# EAGLE schematic main (EAGLE 7.6.0), part 1 of 2
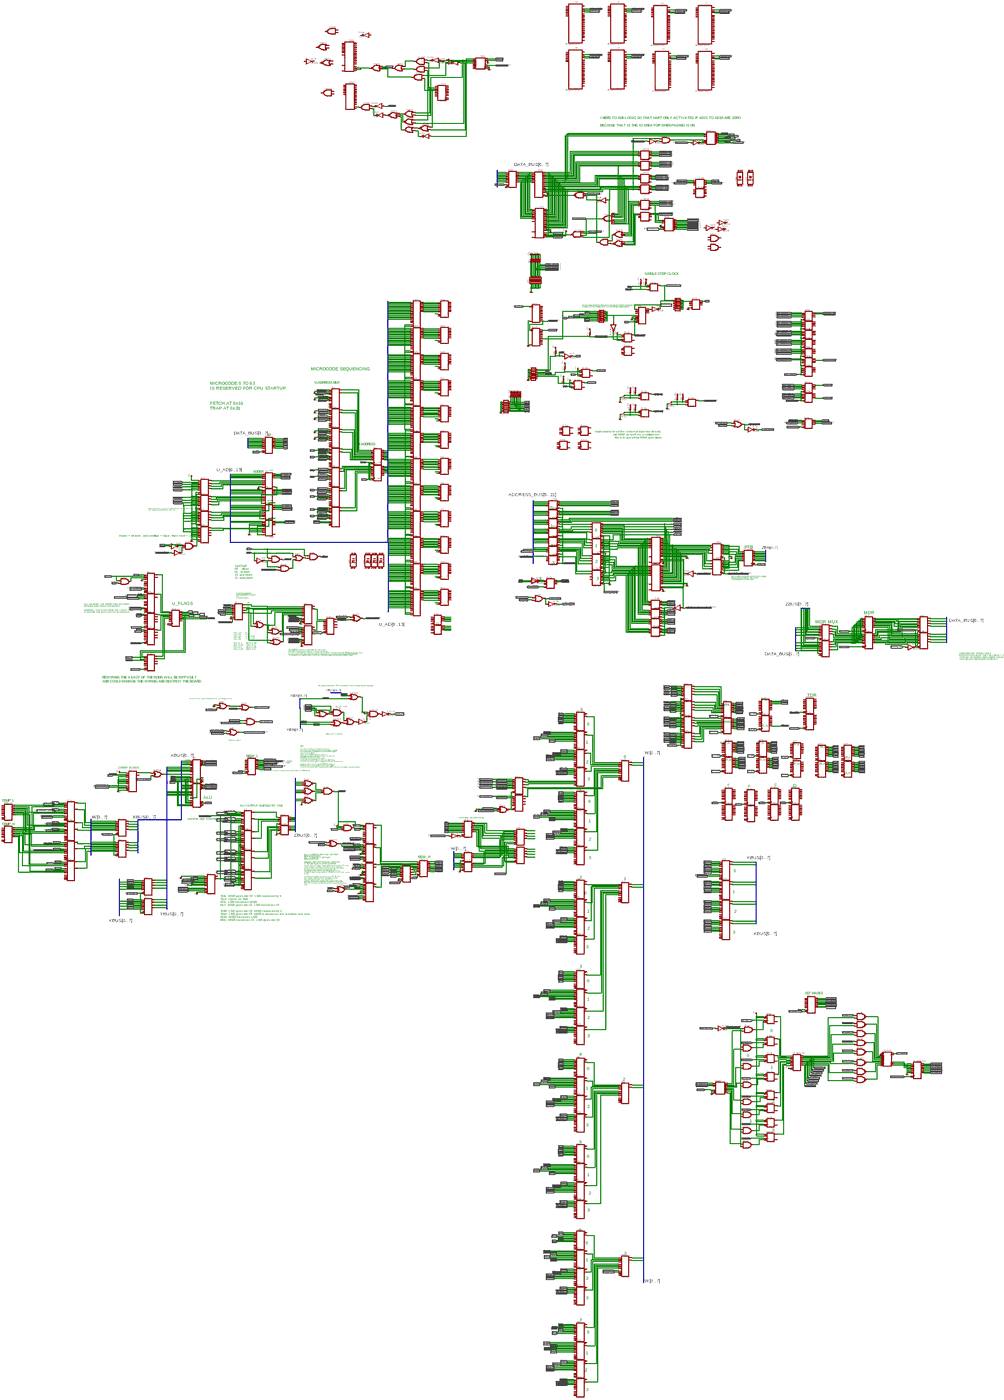
[diagram p0: schematic, sheet 1, overview]
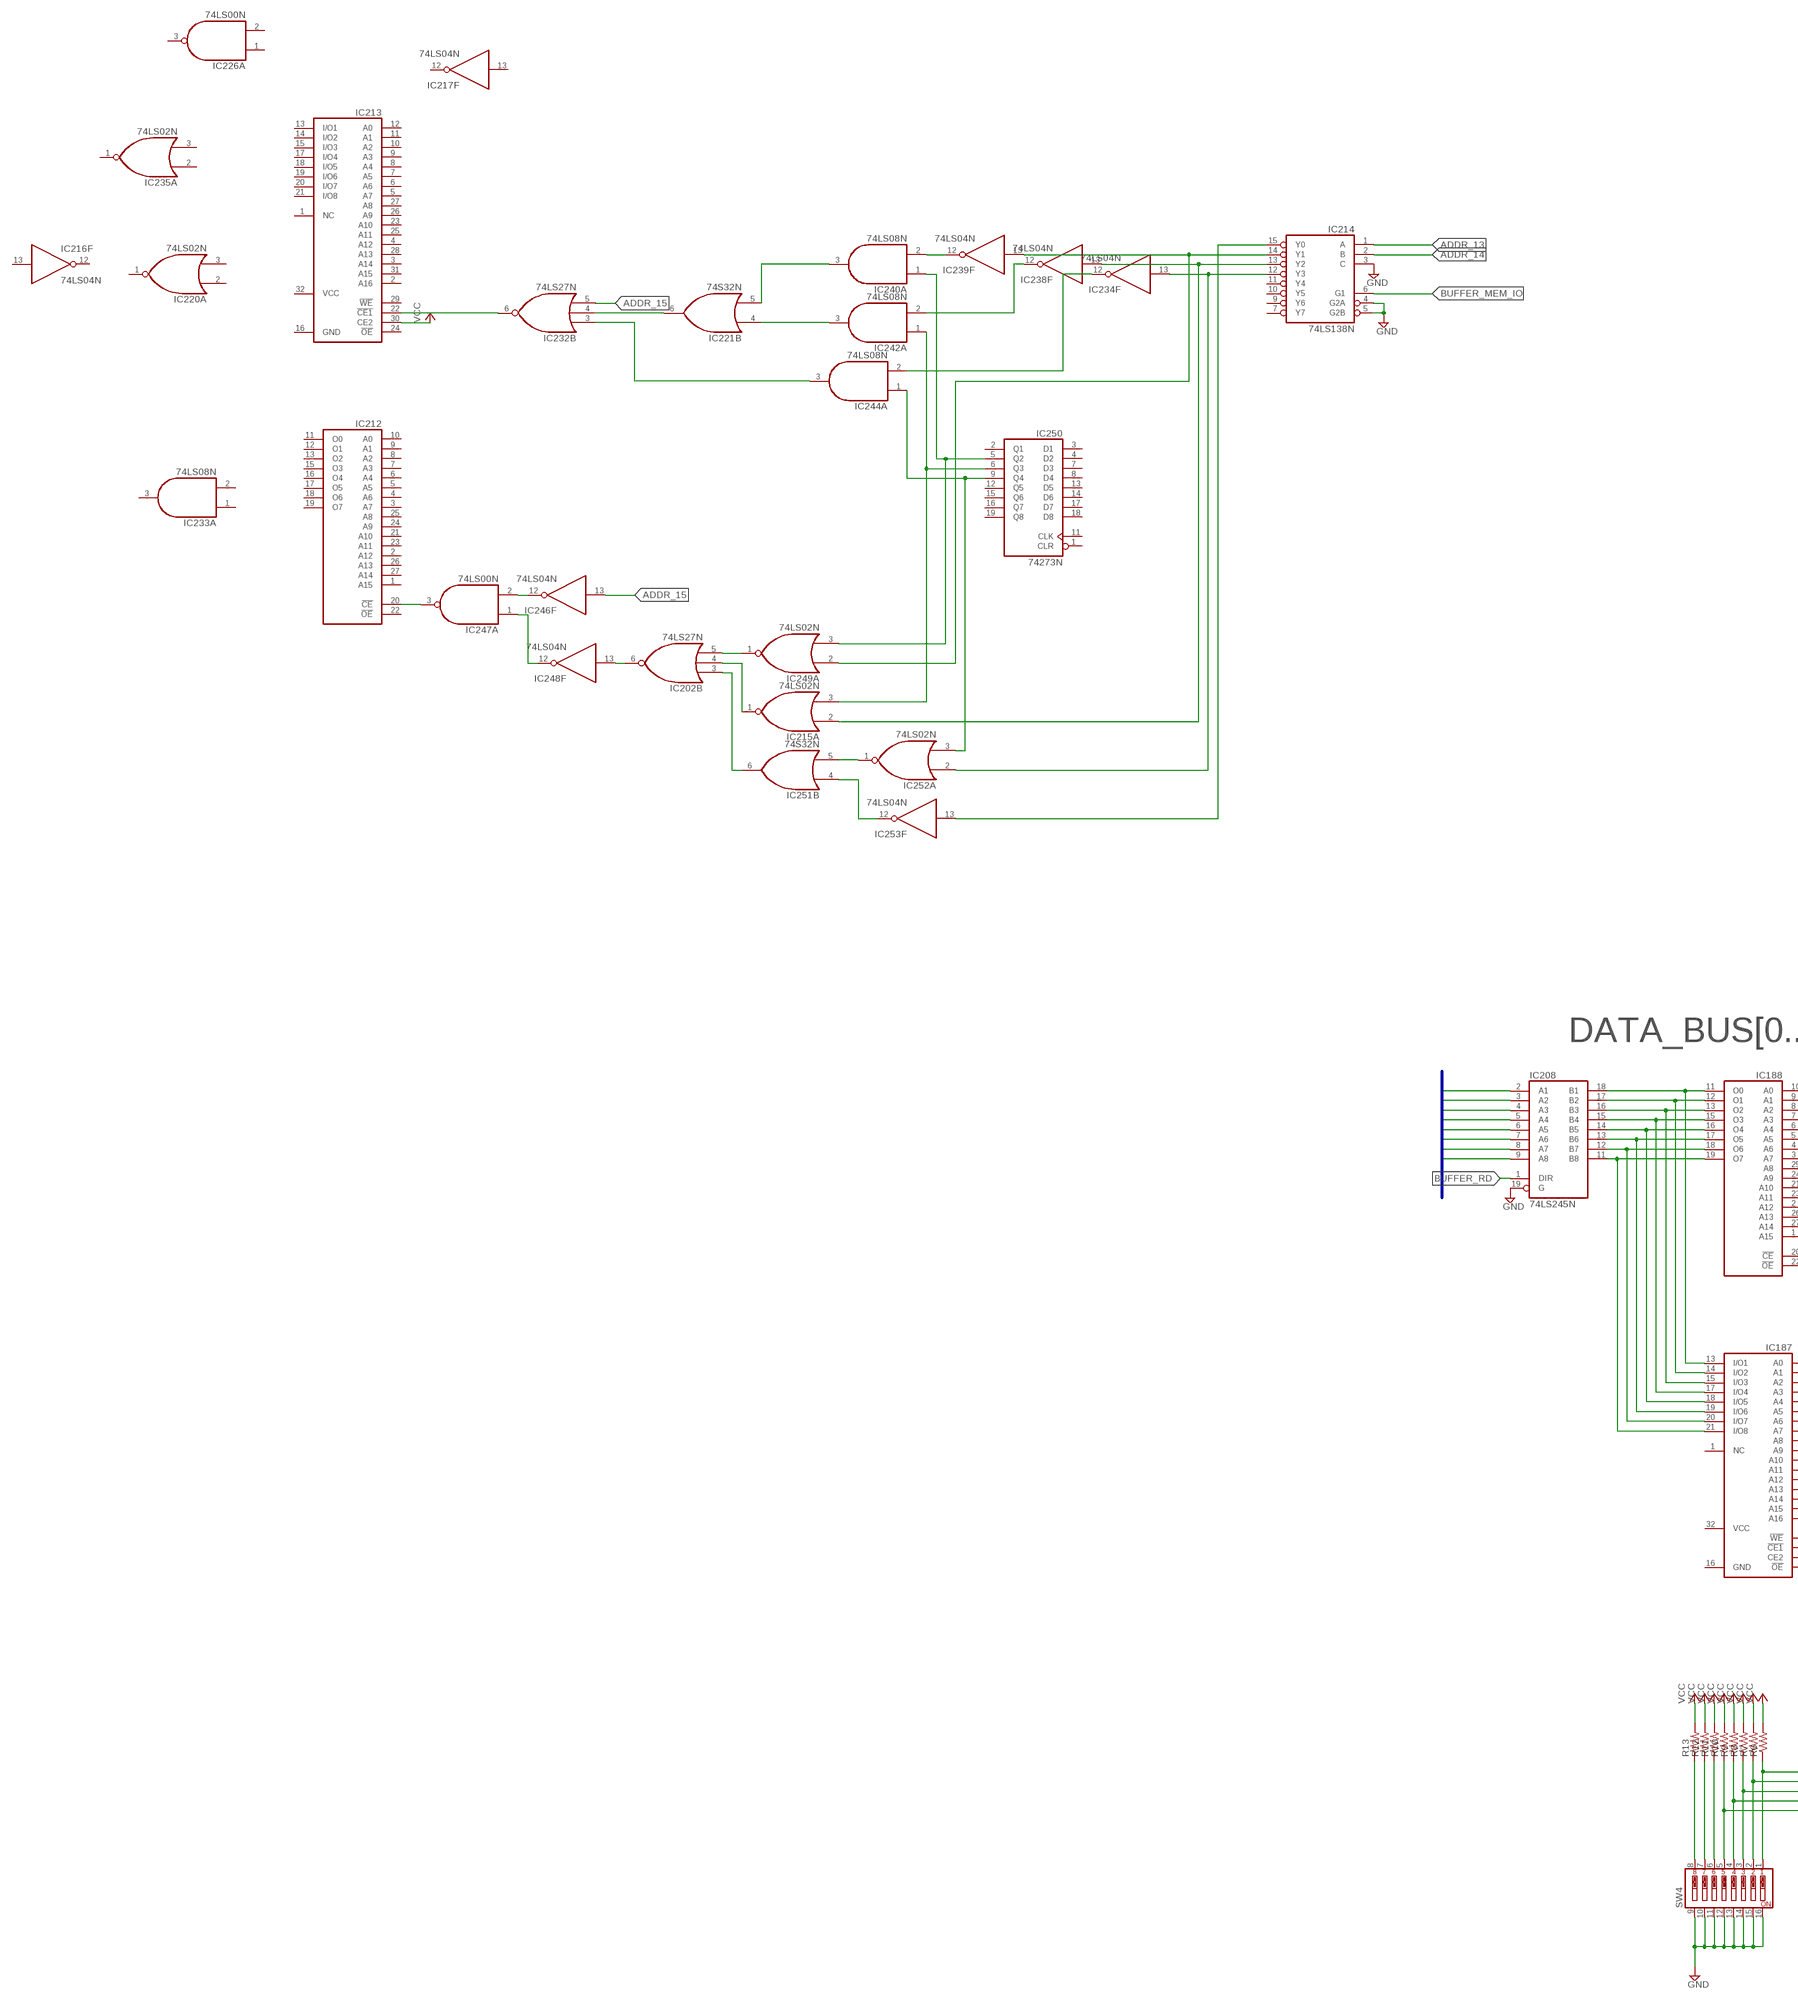
[diagram p1: schematic, sheet 1, part 1 of 8]
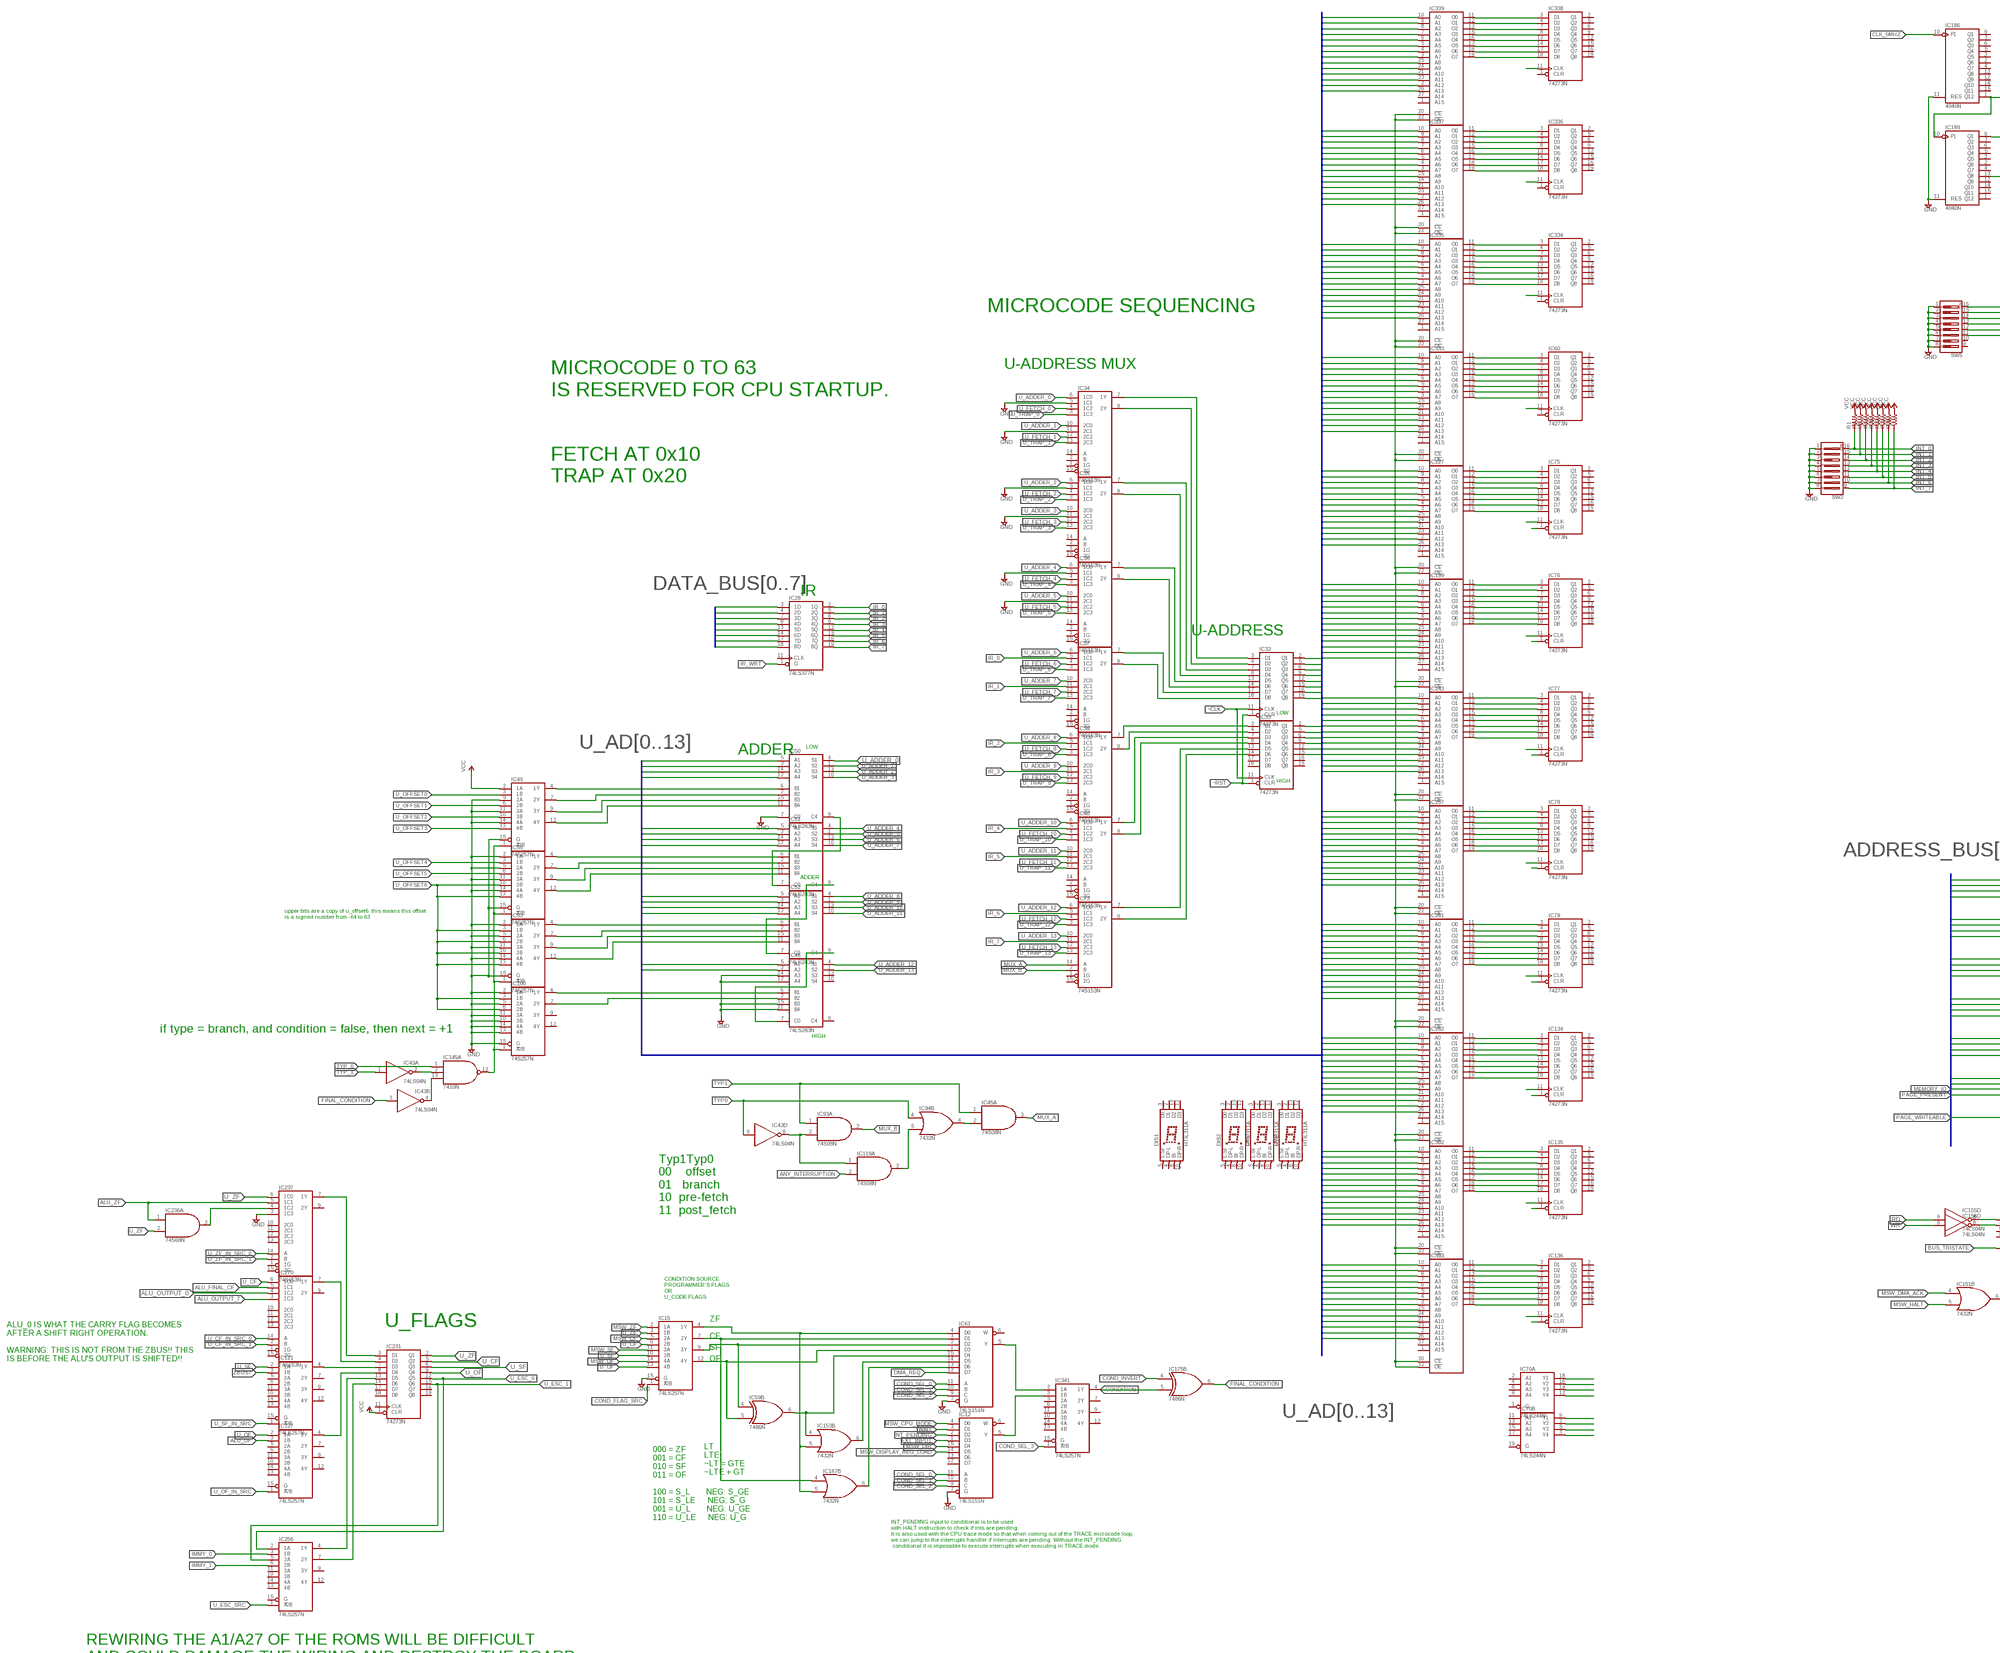
[diagram p2: schematic, sheet 1, part 2 of 8]
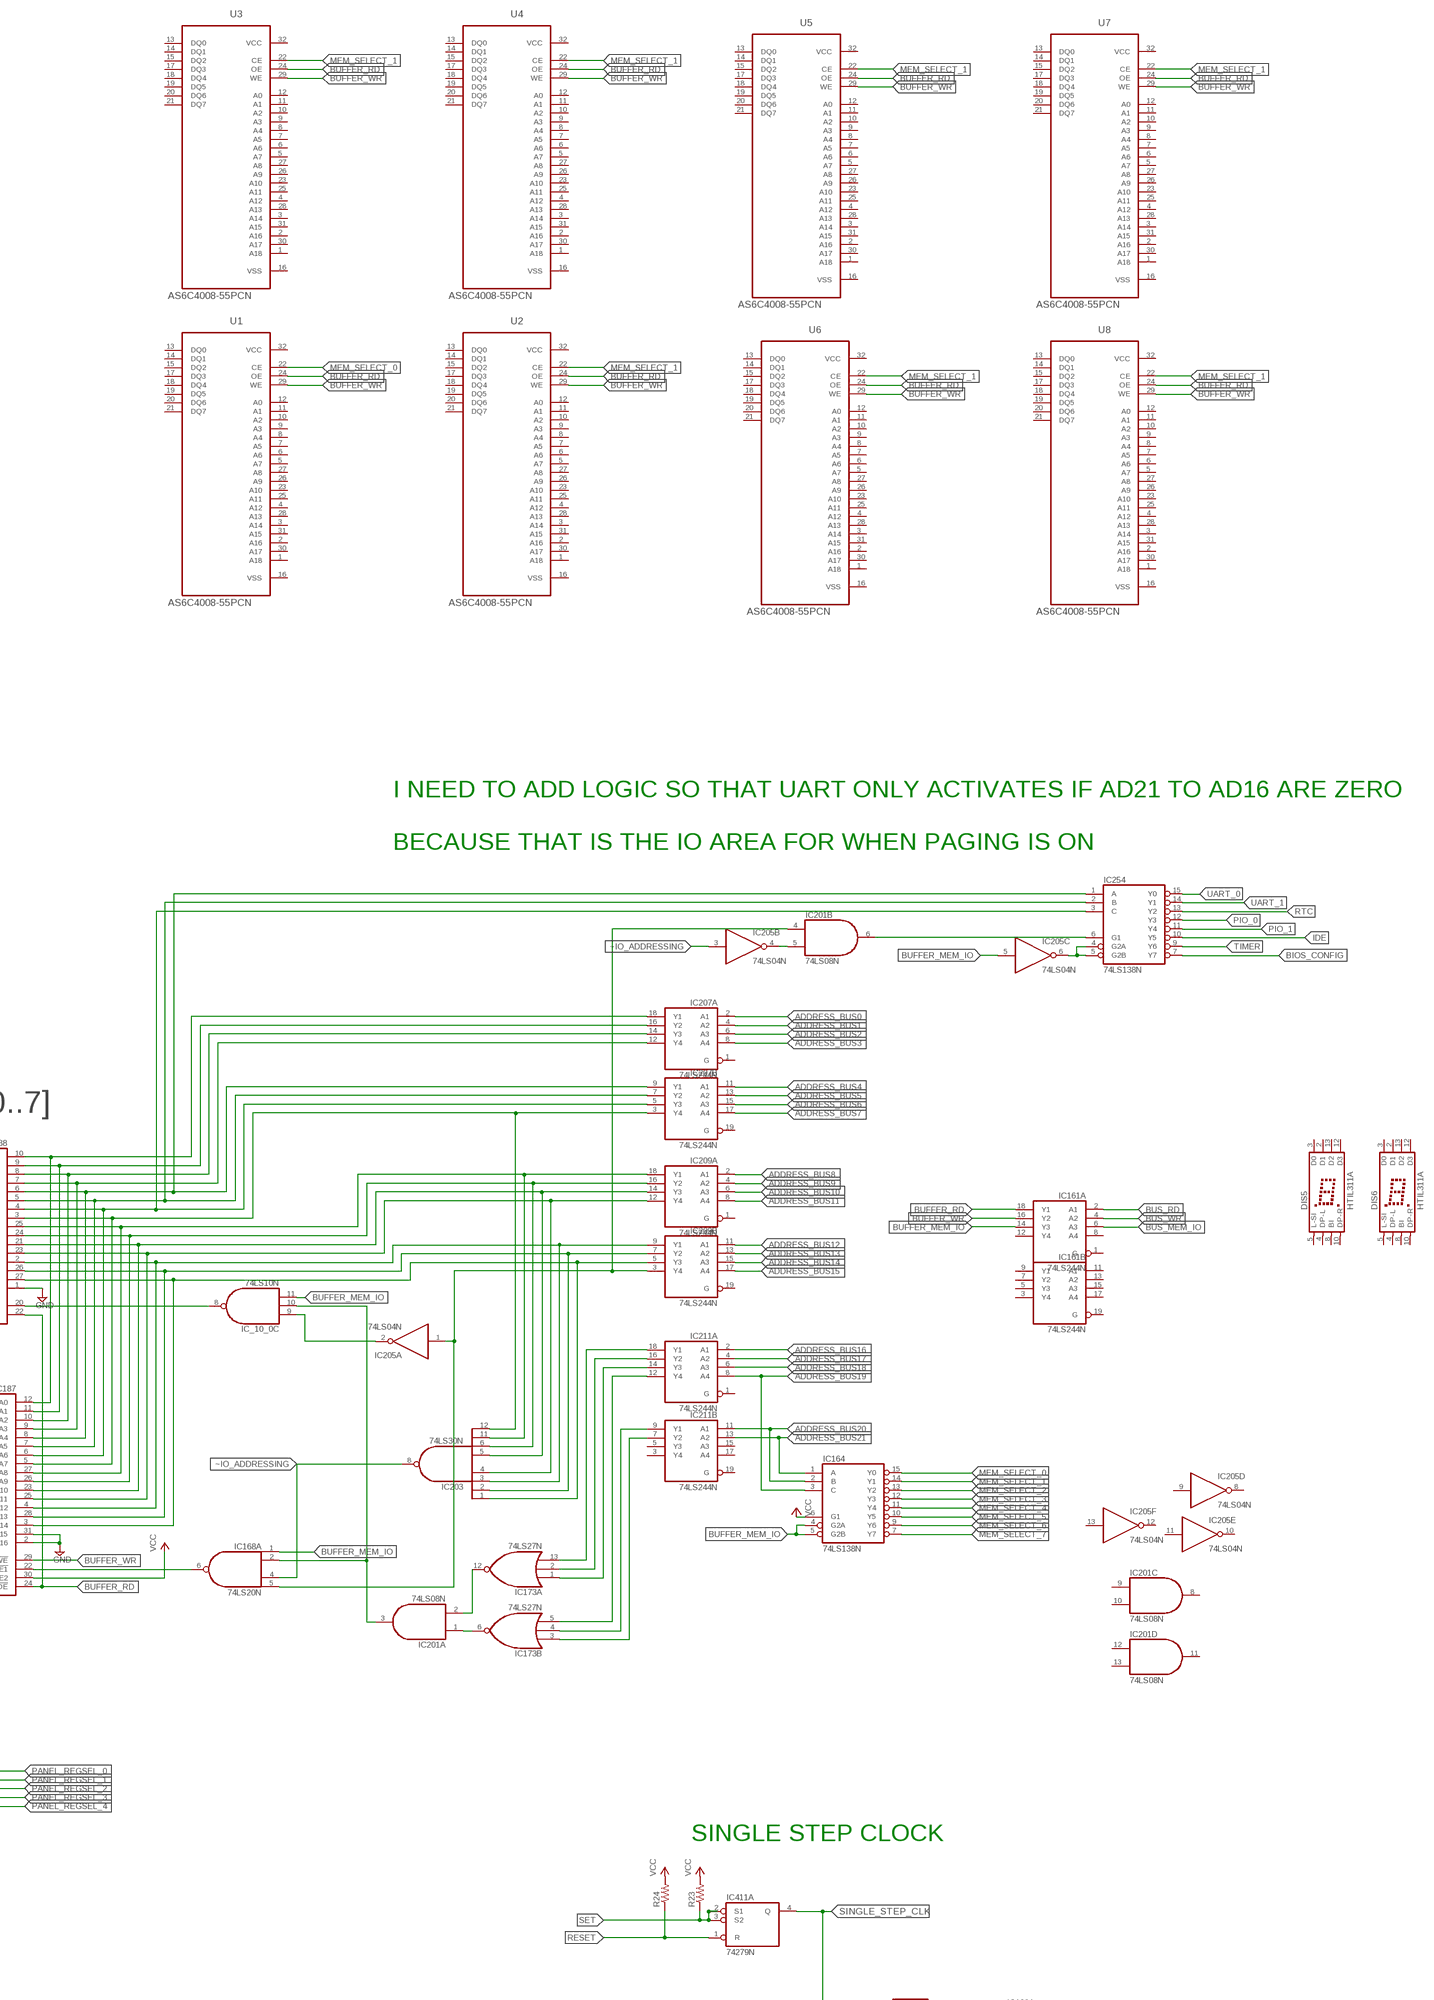
[diagram p3: schematic, sheet 1, part 3 of 8]
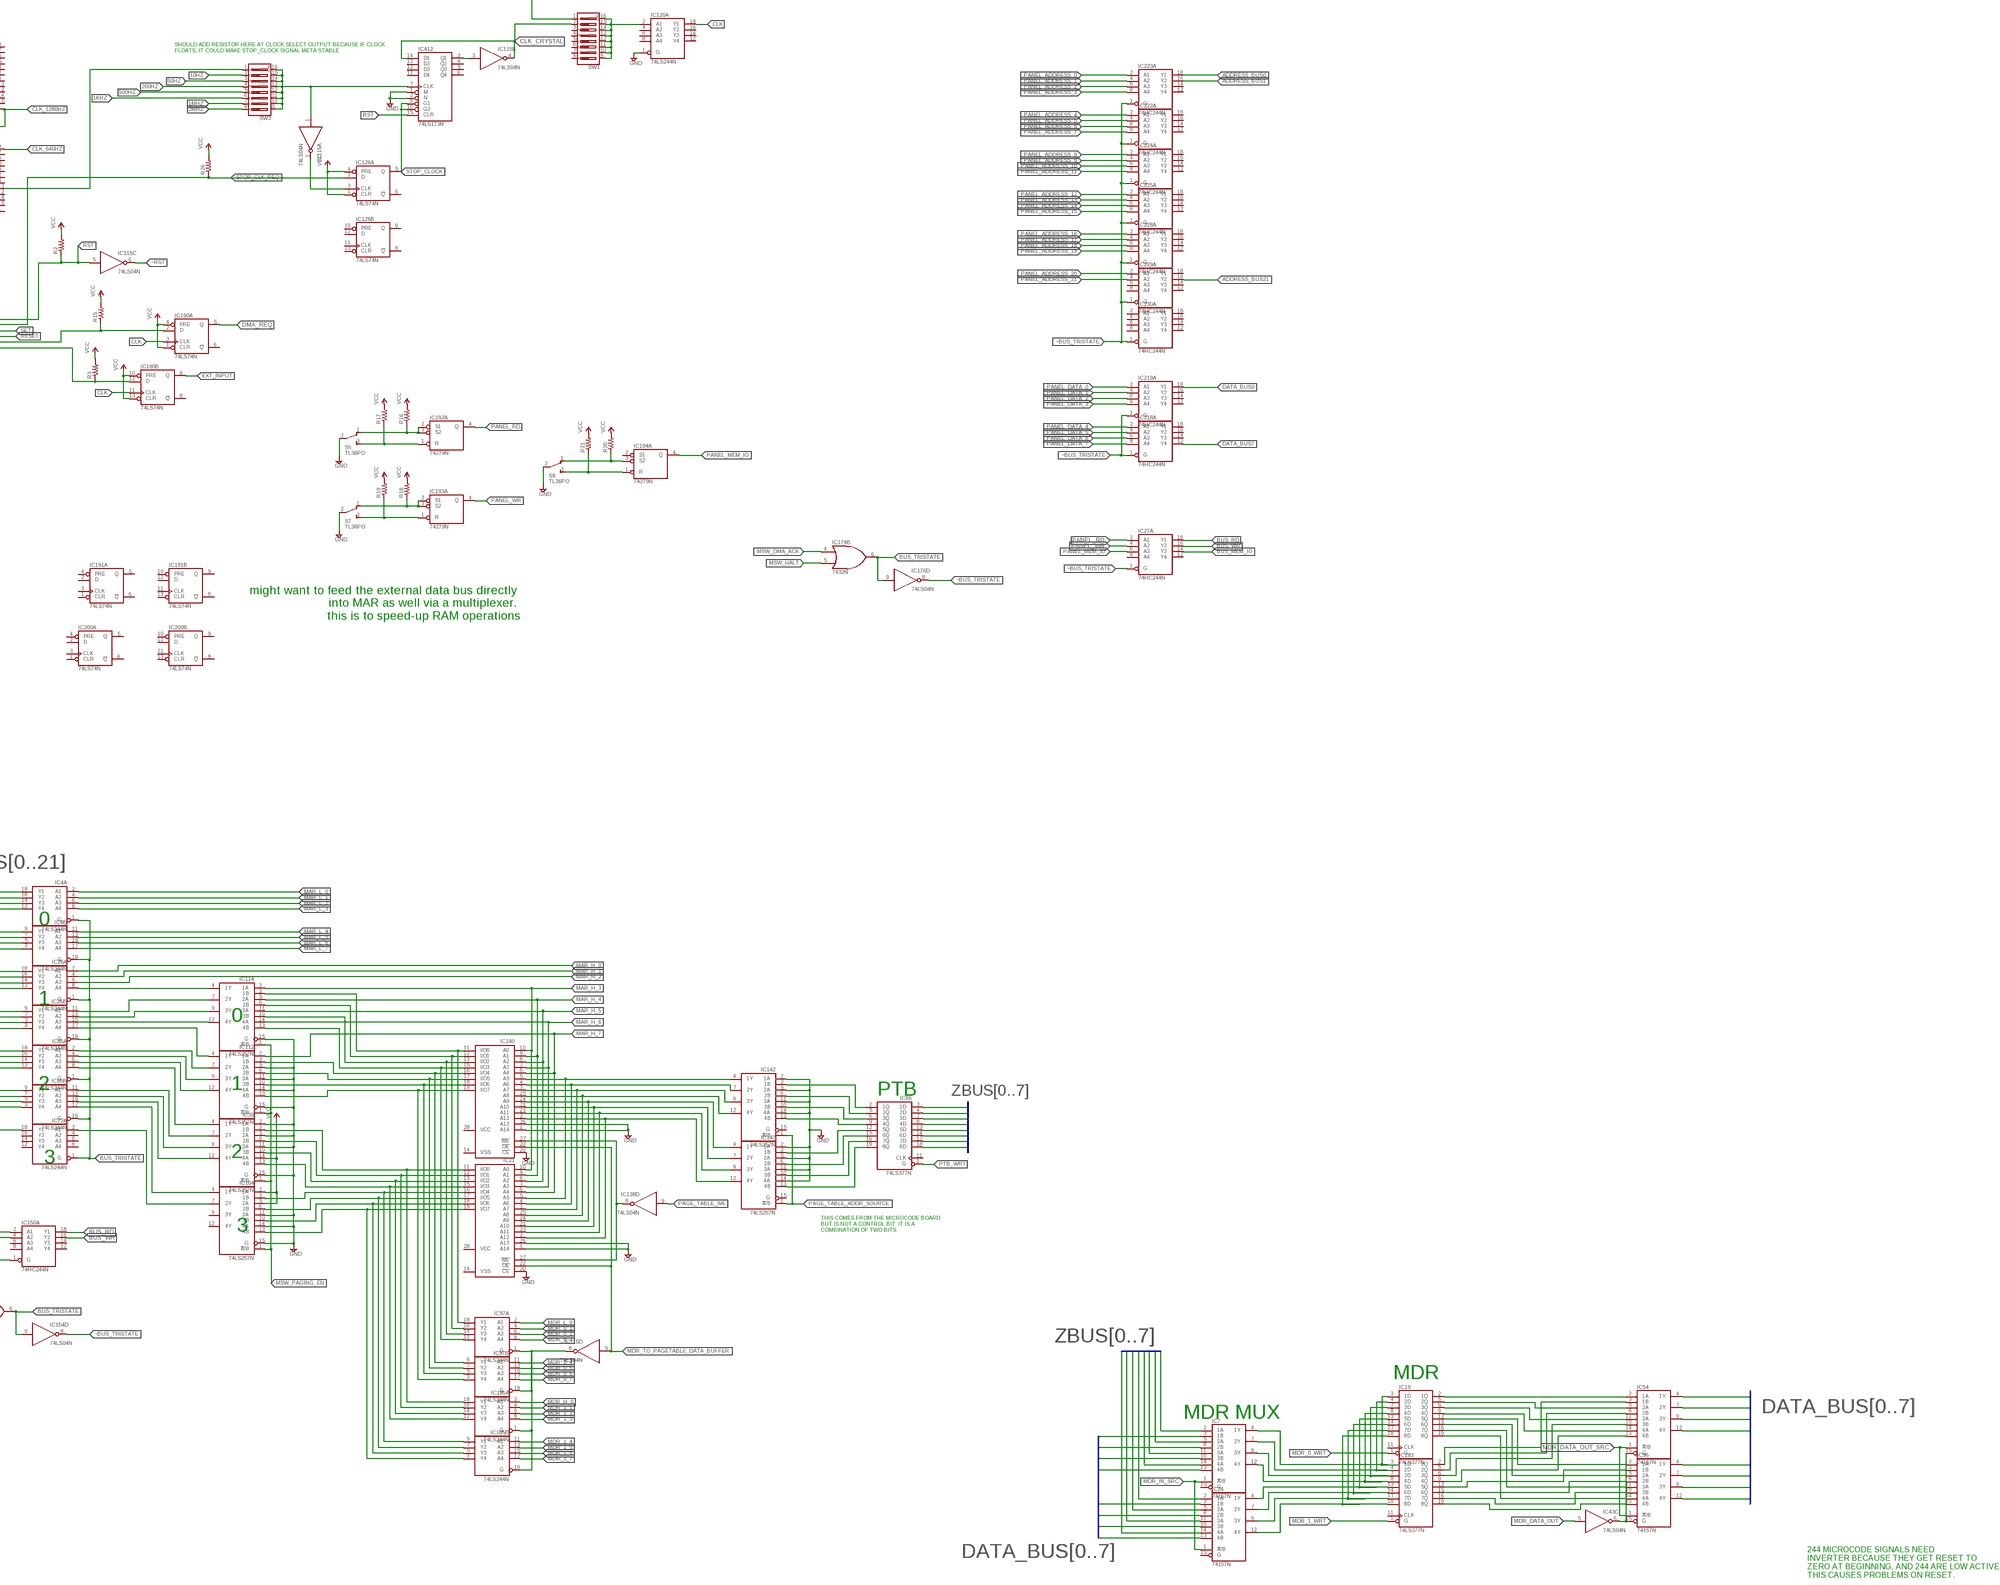
[diagram p4: schematic, sheet 1, part 4 of 8]
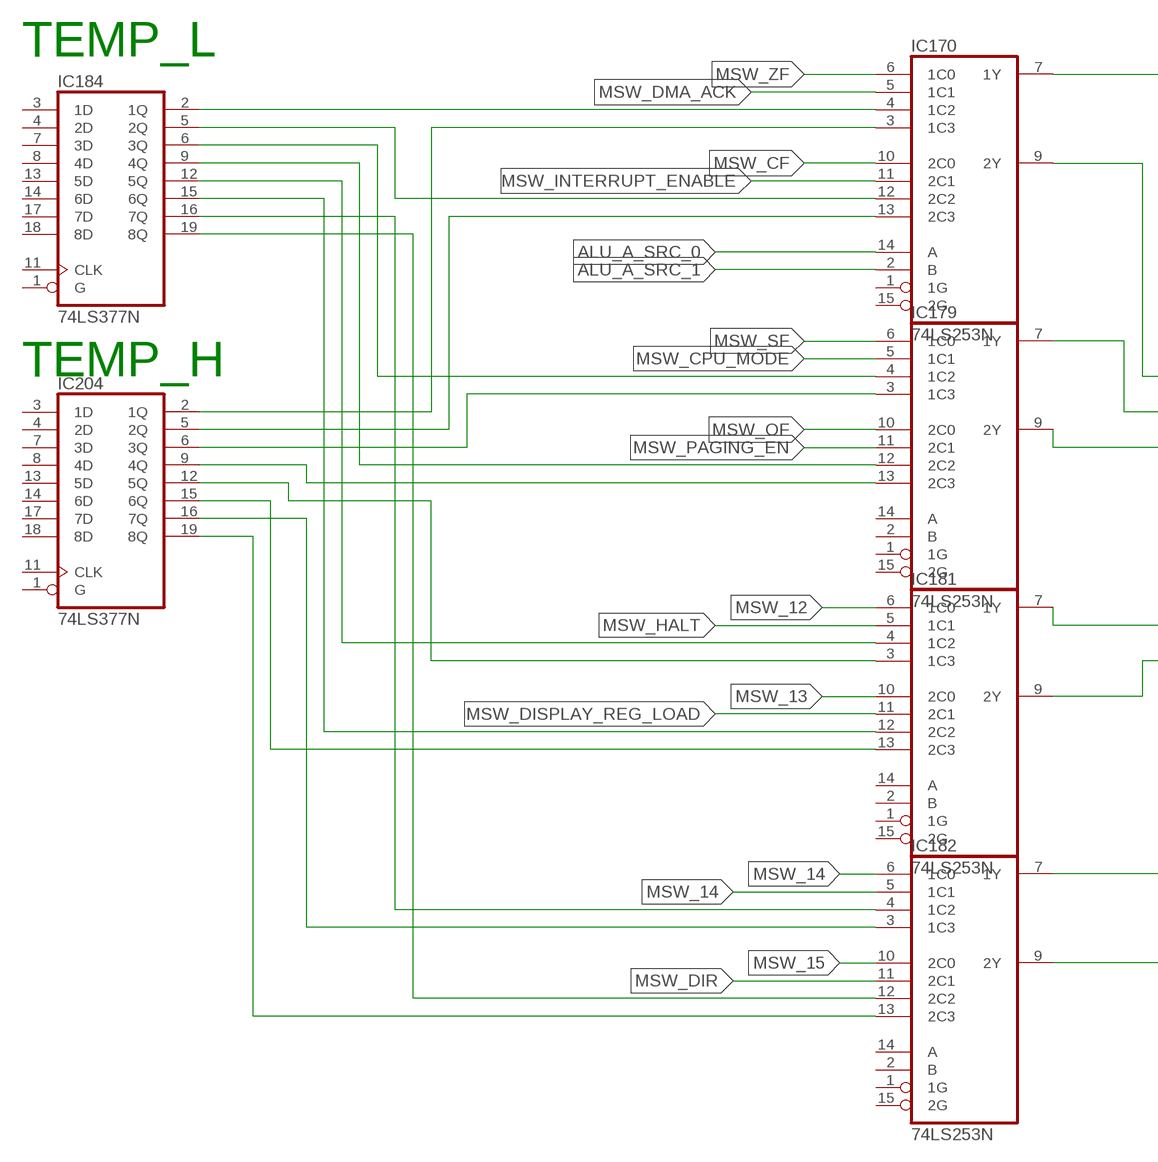
[diagram p5: schematic, sheet 1, part 5 of 8]
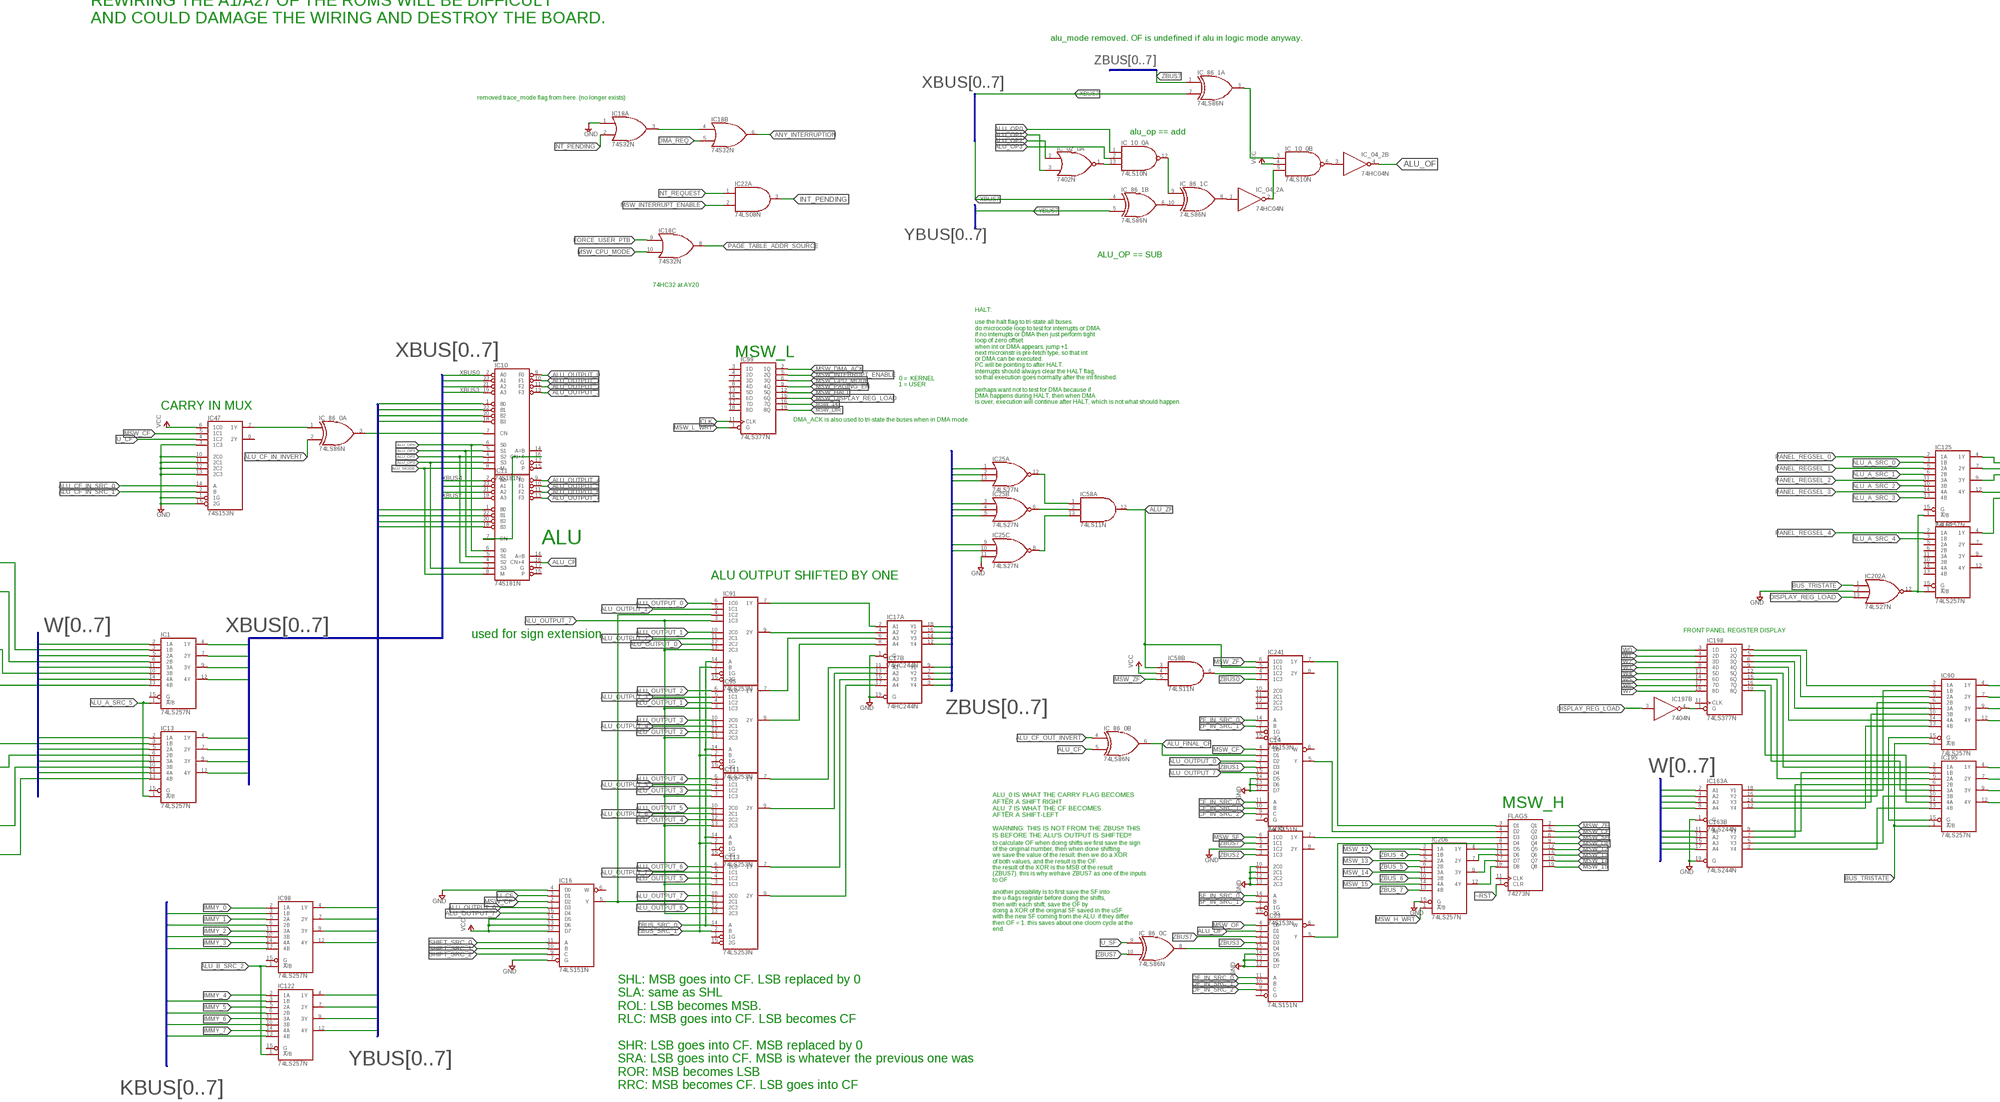
[diagram p6: schematic, sheet 1, part 6 of 8]
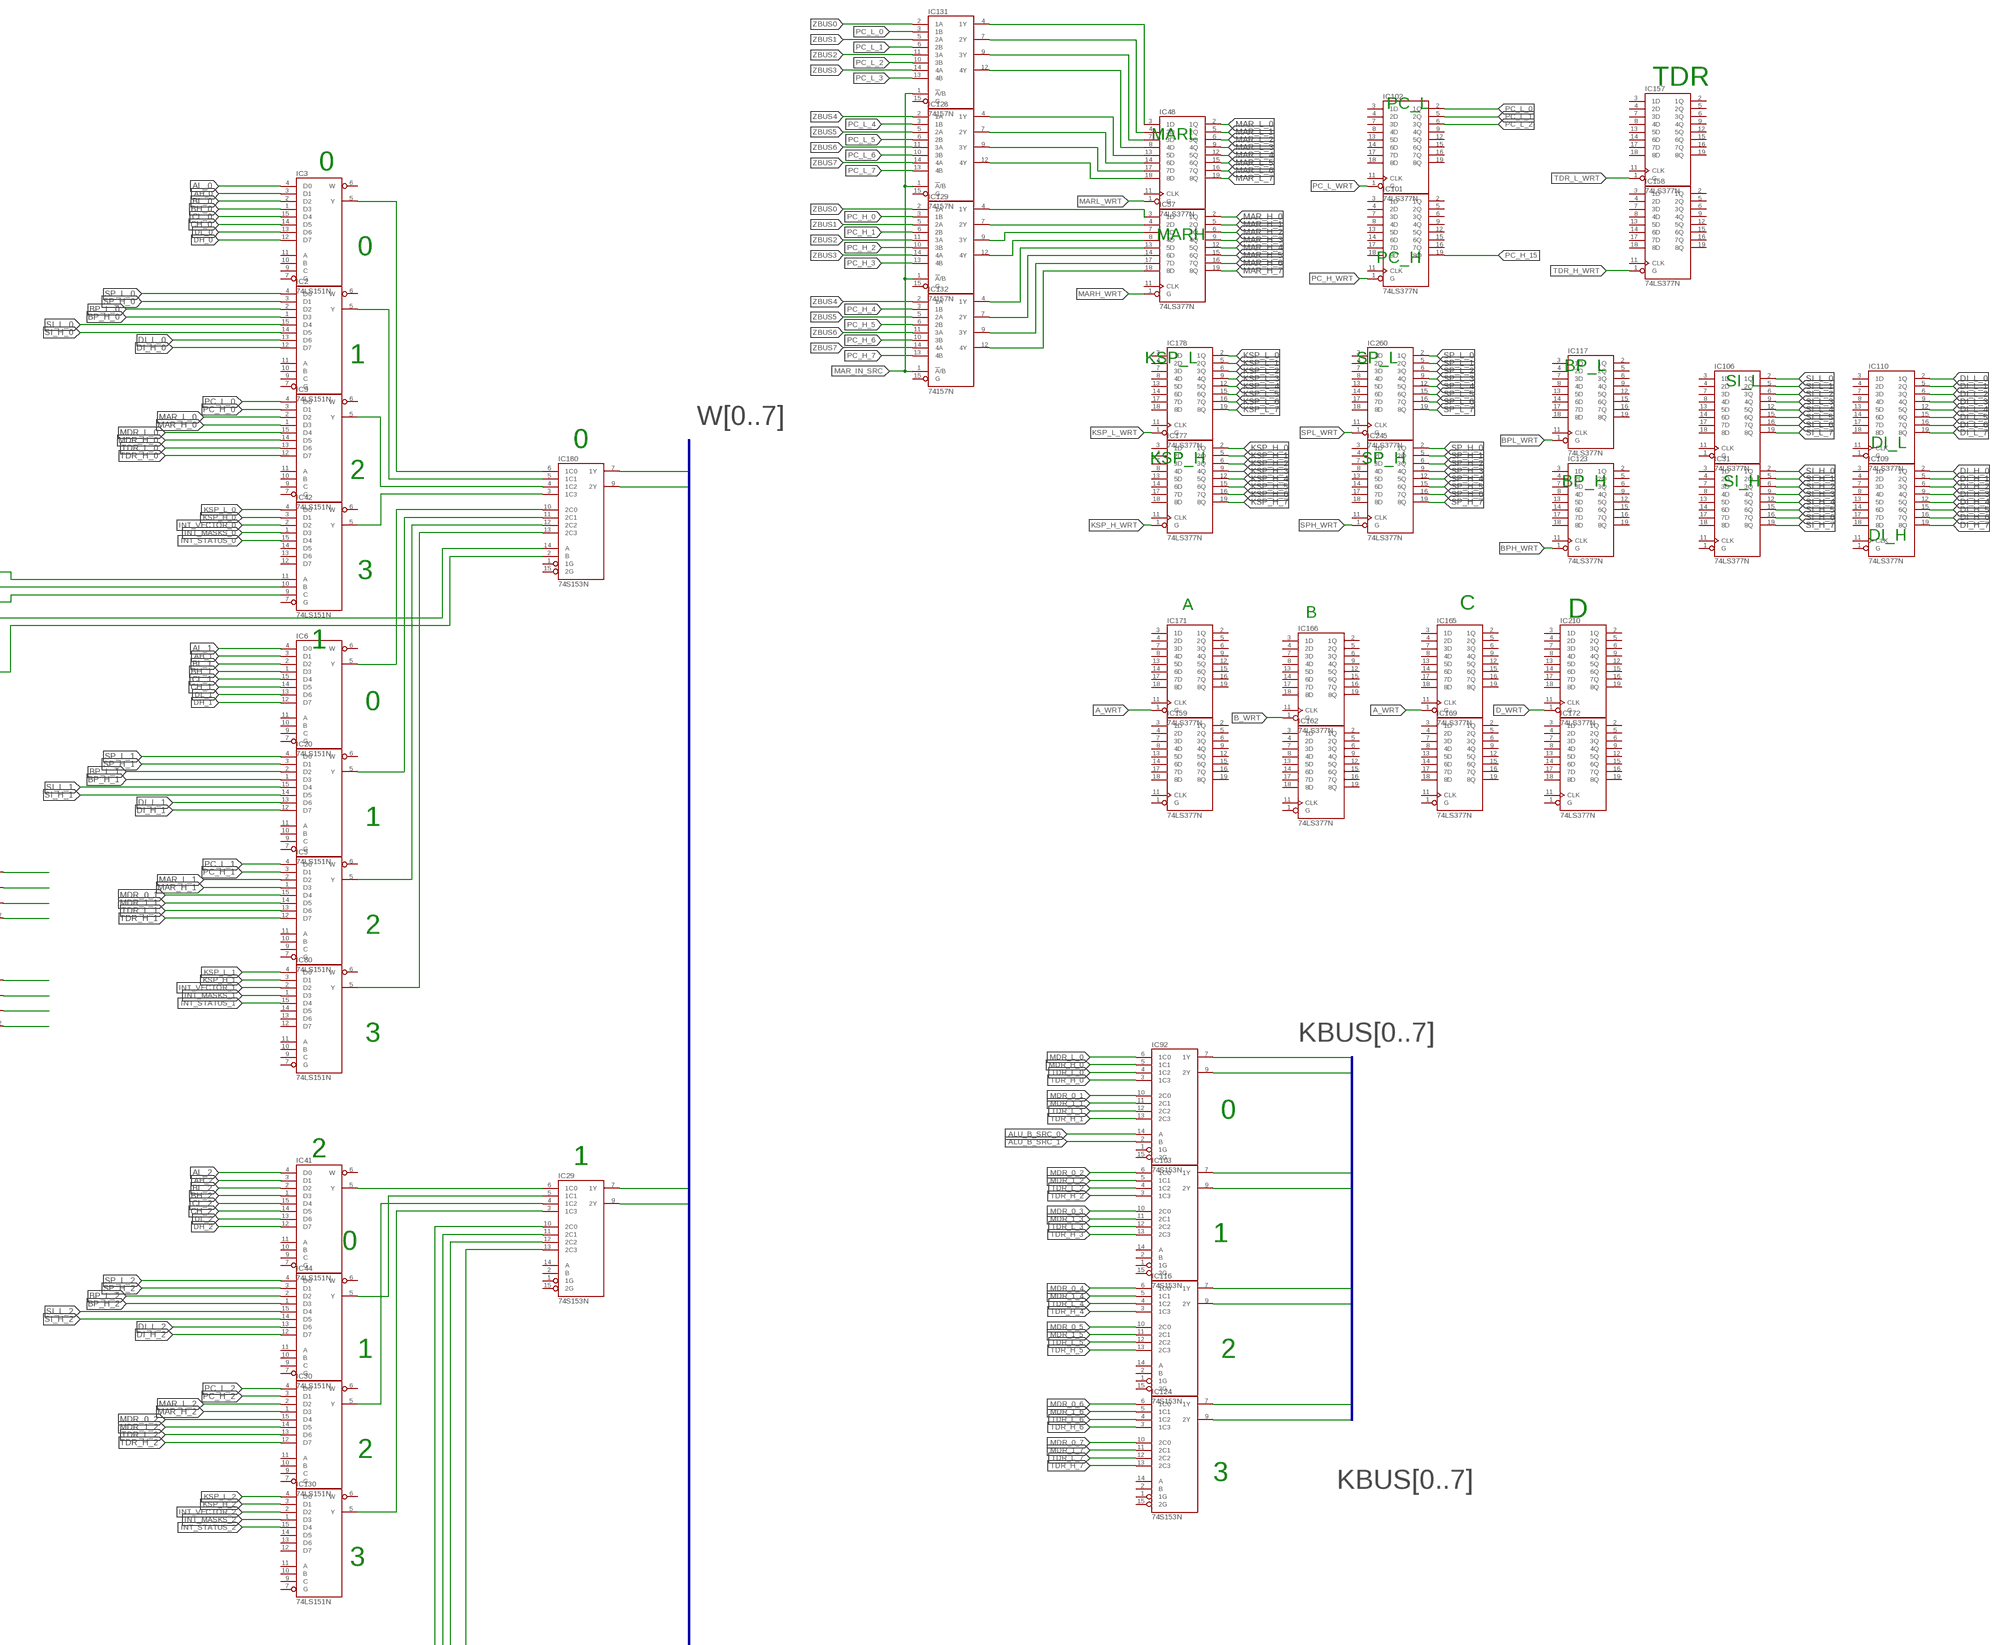
[diagram p7: schematic, sheet 1, part 7 of 8]
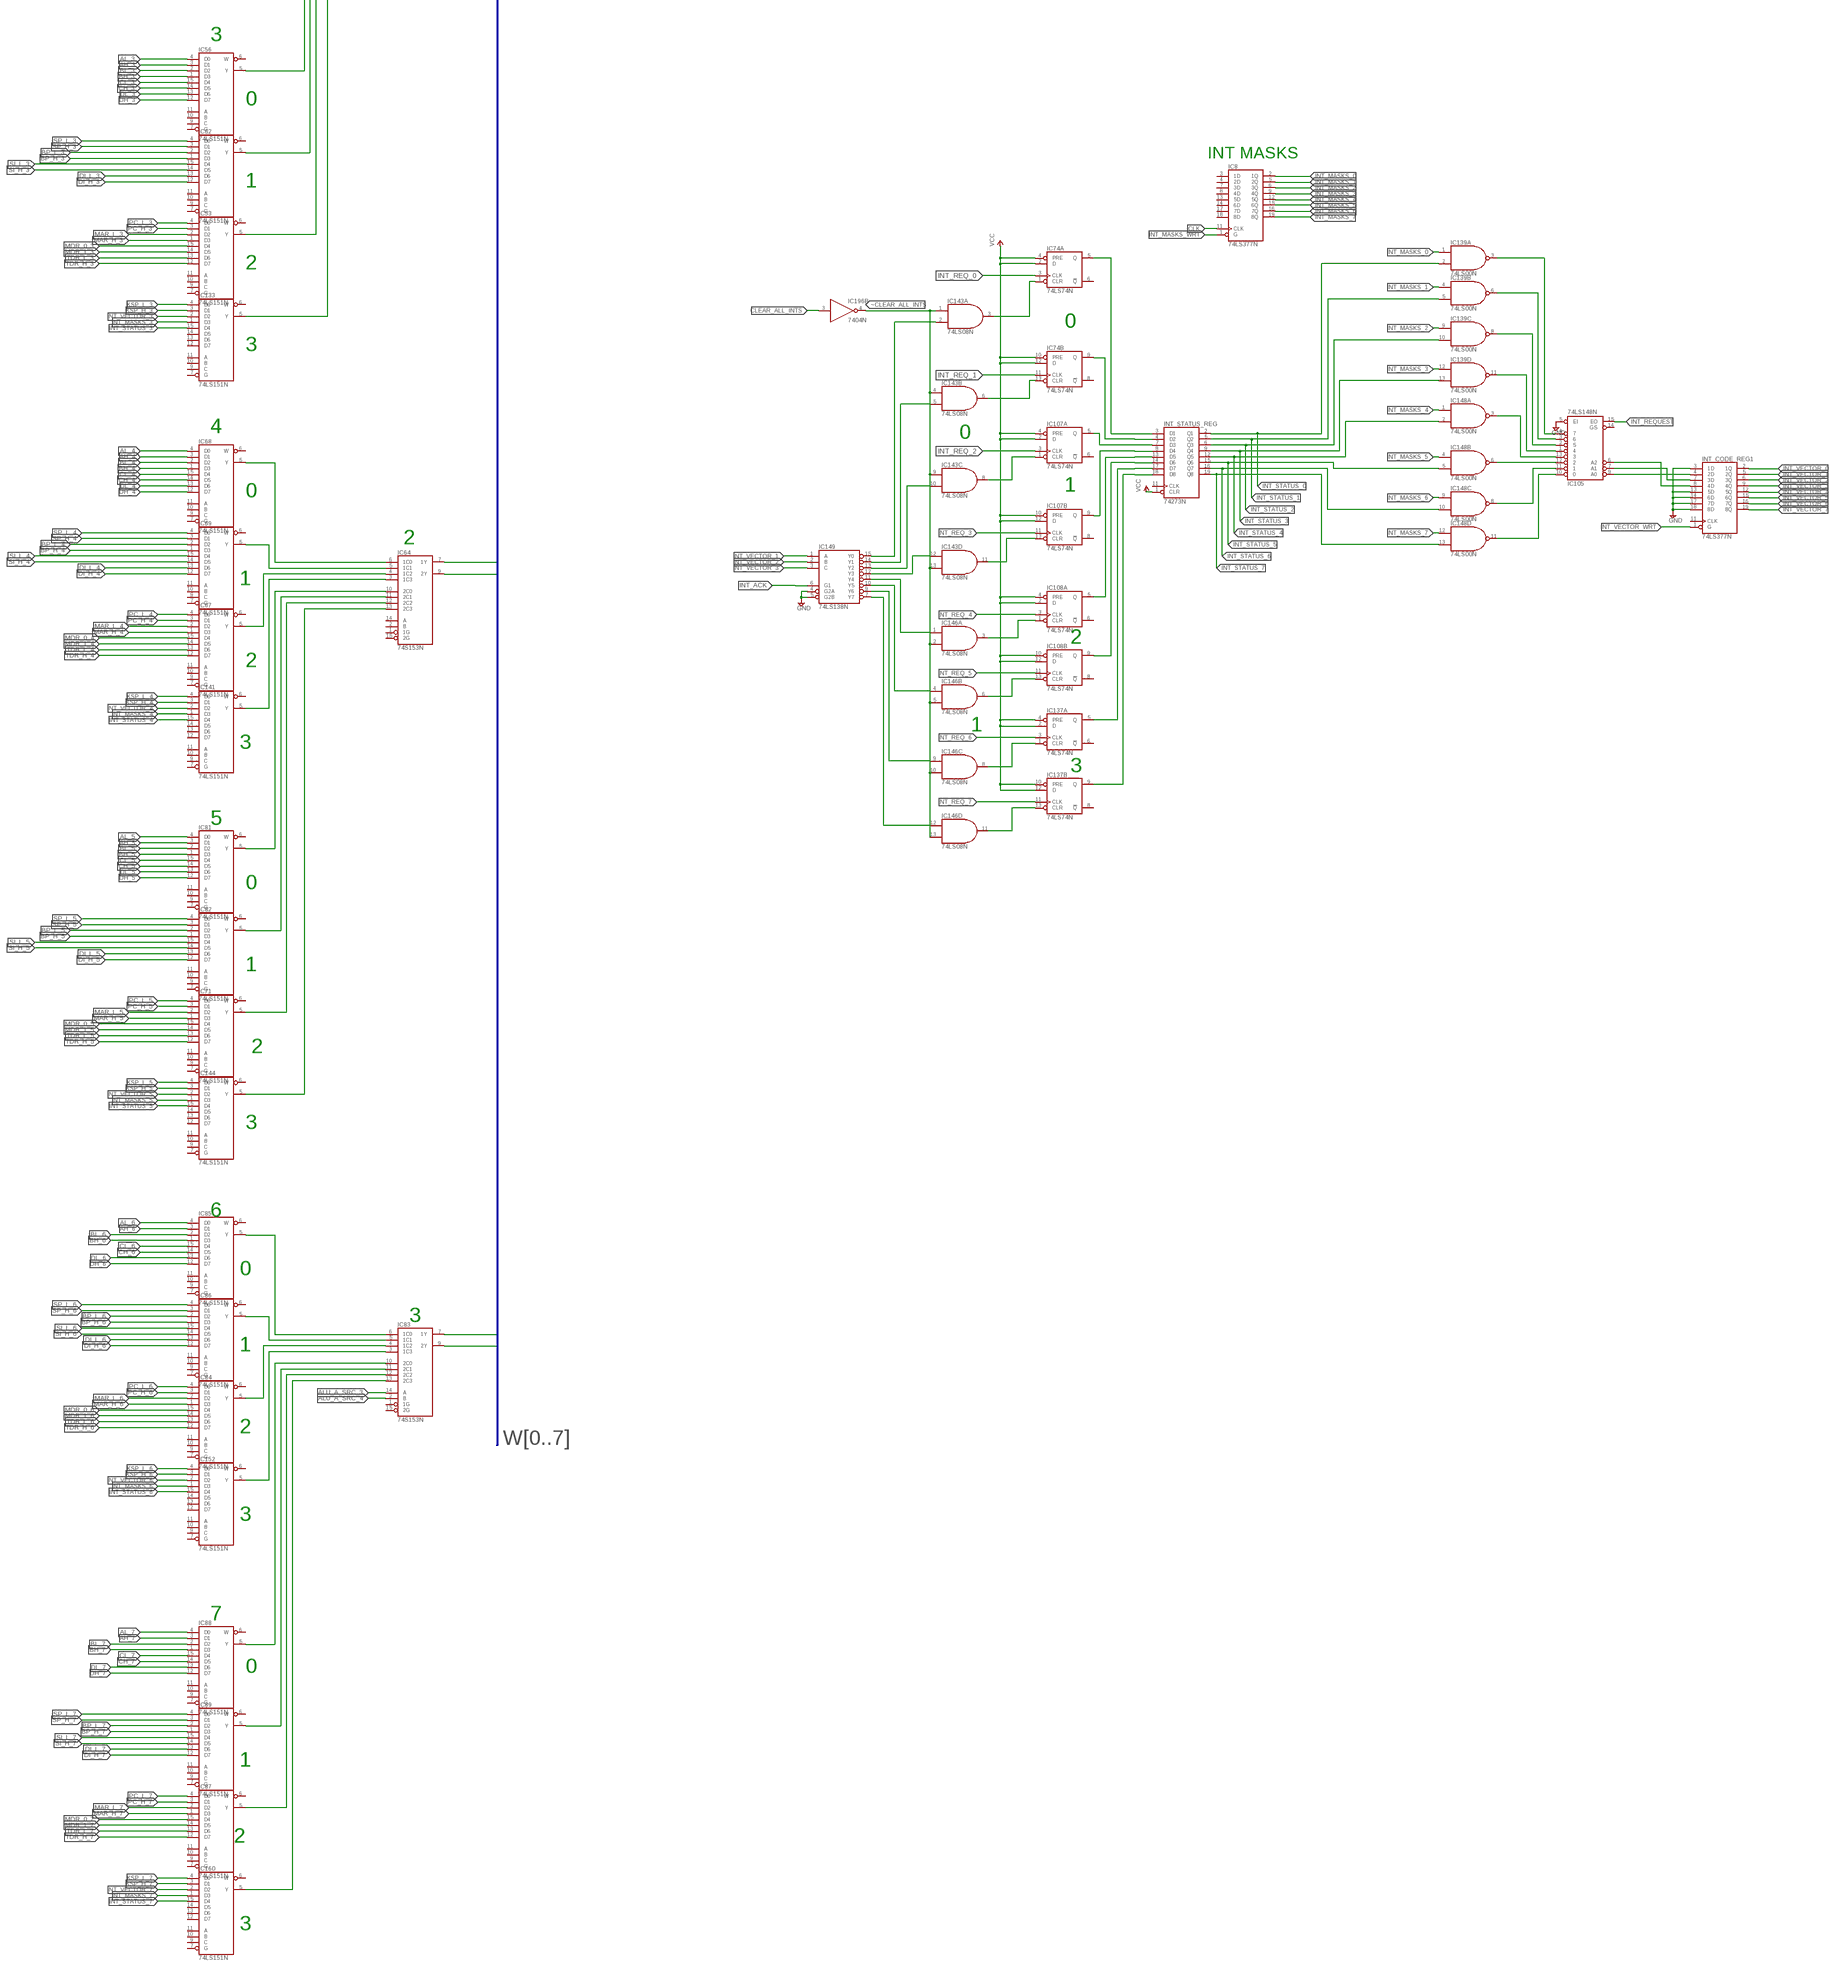
[diagram p8: schematic, sheet 1, part 8 of 8]

## Parts
DIS1  HTIL311A  [HTIL311A]
DIS2  HTIL311A  [HTIL311A]
DIS3  HTIL311A  [HTIL311A]
DIS4  HTIL311A  [HTIL311A]
DIS5  HTIL311A  [HTIL311A]
DIS6  HTIL311A  [HTIL311A]
FLAGS  74273N  [DIL20]
IC1  74LS257N  [DIL16]
IC2  74LS151N  [DIL16]
IC3  74LS151N  [DIL16]
IC4  74LS244N  [DIL20]
IC5  74LS151N  [DIL16]
IC6  74LS151N  [DIL16]
IC7  74157N  [DIL16]
IC8  74LS377N  [DIL20]
IC9  74LS151N  [DIL16]
IC10  74S181N  [DIL24-6]
IC11  74S181N  [DIL24-6]
IC12  74LS151N  [DIL16]
IC13  74LS257N  [DIL16]
IC14  74LS151N  [DIL16]
IC15  74LS257N  [DIL16]
IC16  74LS151N  [DIL16]
IC17  74HC244N  [DIL20]
IC18  74S32N  [DIL14]
IC19  74LS377N  [DIL20]
IC20  74LS151N  [DIL16]
IC21  58C256P  [DIL28-6]
IC22  74LS08N  [DIL14]
IC23  74LS151N  [DIL16]
IC24  74157N  [DIL16]
IC25  74LS27N  [DIL14]
IC26  74LS244N  [DIL20]
IC27  74HC244N  [DIL20]
IC28  74LS377N  [DIL20]
IC29  74S153N  [DIL16]
IC30  74LS151N  [DIL16]
IC31  74LS377N  [DIL20]
IC32  74273N  [DIL20]
IC33  74273N  [DIL20]
IC34  74S153N  [DIL16]
IC35  74S153N  [DIL16]
IC36  74S153N  [DIL16]
IC37  74S153N  [DIL16]
IC38  74S153N  [DIL16]
IC39  74LS257N  [DIL16]
IC40  74S153N  [DIL16]
IC41  74LS151N  [DIL16]
IC42  74LS151N  [DIL16]
IC43  74LS04N  [DIL14]
IC44  74LS151N  [DIL16]
IC45  74S08N  [DIL14]
IC46  74LS283N  [DIL16]
IC47  74S153N  [DIL16]
IC48  74LS377N  [DIL20]
IC49  74S257N  [DIL16]
IC50  74LS283N  [DIL16]
IC51  74LS283N  [DIL16]
IC52  74LS283N  [DIL16]
IC53  74LS151N  [DIL16]
IC54  74157N  [DIL16]
IC55  74S257N  [DIL16]
IC56  74LS151N  [DIL16]
IC57  74LS377N  [DIL20]
IC58  74LS11N  [DIL14]
IC59  7486N  [DIL14]
IC60  74273N  [DIL20]
IC61  74LS151N  [DIL16]
IC62  74LS151N  [DIL16]
IC63  74S257N  [DIL16]
IC64  74S153N  [DIL16]
IC65  74LS244N  [DIL20]
IC66  74LS377N  [DIL20]
IC67  74LS151N  [DIL16]
IC68  74LS151N  [DIL16]
IC69  74LS151N  [DIL16]
IC70  74LS244N  [DIL20]
IC71  74LS151N  [DIL16]
IC72  74LS244N  [DIL20]
IC73  74S153N  [DIL16]
IC74  74LS74N  [DIL14]
IC75  74273N  [DIL20]
IC76  74273N  [DIL20]
IC77  74273N  [DIL20]
IC78  74273N  [DIL20]
IC79  74273N  [DIL20]
IC80  74LS151N  [DIL16]
IC81  74LS151N  [DIL16]
IC82  74LS151N  [DIL16]
IC83  74S153N  [DIL16]
IC84  74LS151N  [DIL16]
IC85  74LS151N  [DIL16]
IC86  74LS151N  [DIL16]
IC87  74LS151N  [DIL16]
IC88  74LS151N  [DIL16]
IC89  74LS151N  [DIL16]
IC90  74LS257N  [DIL16]
IC91  74LS253N  [DIL16]
IC92  74S153N  [DIL16]
IC93  74S08N  [DIL14]
IC94  7432N  [DIL14]
IC95  74LS253N  [DIL16]
IC96  74157N  [DIL16]
IC97  74LS244N  [DIL20]
IC98  74LS257N  [DIL16]
IC99  74LS377N  [DIL20]
IC100  74S257N  [DIL16]
IC101  74LS377N  [DIL20]
IC102  74LS377N  [DIL20]
IC103  74S153N  [DIL16]
IC104  74LS257N  [DIL16]
IC105  74LS148N  [DIL16]
IC106  74LS377N  [DIL20]
IC107  74LS74N  [DIL14]
IC108  74LS74N  [DIL14]
IC109  74LS377N  [DIL20]
IC110  74LS377N  [DIL20]
IC111  74LS253N  [DIL16]
IC112  74LS257N  [DIL16]
IC113  74LS253N  [DIL16]
IC114  74LS257N  [DIL16]
IC115  74LS04N  [DIL14]
IC116  74S153N  [DIL16]
IC117  74LS377N  [DIL20]
IC118  74LS257N  [DIL16]
IC119  74S08N  [DIL14]
IC120  74LS244N  [DIL20]
IC121  74LS257N  [DIL16]
IC122  74LS257N  [DIL16]
IC123  74LS377N  [DIL20]
IC124  74S153N  [DIL16]
IC125  74LS257N  [DIL16]
IC126  74LS74N  [DIL14]
IC127  74LS257N  [DIL16]
IC128  74157N  [DIL16]
IC129  74157N  [DIL16]
IC130  74LS151N  [DIL16]
IC131  74157N  [DIL16]
IC132  74157N  [DIL16]
IC133  74LS151N  [DIL16]
IC134  74273N  [DIL20]
IC135  74273N  [DIL20]
IC136  74273N  [DIL20]
IC137  74LS74N  [DIL14]
IC138  74LS04N  [DIL14]
IC139  74LS00N  [DIL14]
IC140  58C256P  [DIL28-6]
IC141  74LS151N  [DIL16]
IC142  74LS257N  [DIL16]
IC143  74LS08N  [DIL14]
IC144  74LS151N  [DIL16]
IC145  7410N  [DIL14]
IC146  74LS08N  [DIL14]
IC147  74LS257N  [DIL16]
IC148  74LS00N  [DIL14]
IC149  74LS138N  [DIL16]
IC150  74HC244N  [DIL20]
IC151  7432N  [DIL14]
IC152  74LS151N  [DIL16]
IC153  7432N  [DIL14]
IC154  74LS04N  [DIL14]
IC155  74LS04N  [DIL14]
IC156  74LS04N  [DIL14]
IC157  74LS377N  [DIL20]
IC158  74LS377N  [DIL20]
IC159  74LS377N  [DIL20]
IC160  74LS151N  [DIL16]
IC161  74LS244N  [DIL20]
IC162  74LS377N  [DIL20]
IC163  74LS244N  [DIL20]
IC164  74LS138N  [DIL16]
IC165  74LS377N  [DIL20]
IC166  74LS377N  [DIL20]
IC167  7432N  [DIL14]
IC168  74LS20N  [DIL14]
IC169  74LS377N  [DIL20]
IC170  74LS253N  [DIL16]
IC171  74LS377N  [DIL20]
IC172  74LS377N  [DIL20]
IC173  74LS27N  [DIL14]
IC174  7432N  [DIL14]
IC175  7486N  [DIL14]
IC176  74LS04N  [DIL14]
IC177  74LS377N  [DIL20]
IC178  74LS377N  [DIL20]
IC179  74LS253N  [DIL16]
IC180  74S153N  [DIL16]
IC181  74LS253N  [DIL16]
IC182  74LS253N  [DIL16]
IC183  74LS377N  [DIL20]
IC184  74LS377N  [DIL20]
IC185  74LS244N  [DIL20]
IC186  4040N  [DIL16]
IC187  431000  [DIL32]
IC188  27512  [DIL28]
IC189  4040N  [DIL16]
IC190  74LS74N  [DIL14]
IC191  74LS74N  [DIL14]
IC192  74279N  [DIL16]
IC193  74279N  [DIL16]
IC194  74279N  [DIL16]
IC195  74LS257N  [DIL16]
IC196  7404N  [DIL14]
IC197  7404N  [DIL14]
IC198  74LS377N  [DIL20]
IC199  27512  [DIL28]
IC200  74LS74N  [DIL14]
IC201  74LS08N  [DIL14]
IC202  74LS27N  [DIL14]
IC203  74LS30N  [DIL14]
IC204  74LS377N  [DIL20]
IC205  74LS04N  [DIL14]
IC206  74LS257N  [DIL16]
IC207  74LS244N  [DIL20]
IC208  74LS245N  [DIL20]
IC209  74LS244N  [DIL20]
IC210  74LS377N  [DIL20]
IC211  74LS244N  [DIL20]
IC212  27512  [DIL28]
IC213  431000  [DIL32]
IC214  74LS138N  [DIL16]
IC215  74LS02N  [DIL14]
IC216  74LS04N  [DIL14]
IC217  74LS04N  [DIL14]
IC218  74HC244N  [DIL20]
IC219  74HC244N  [DIL20]
IC220  74LS02N  [DIL14]
IC221  74S32N  [DIL14]
IC222  74HC244N  [DIL20]
IC223  74HC244N  [DIL20]
IC224  74HC244N  [DIL20]
IC225  74HC244N  [DIL20]
IC226  74LS00N  [DIL14]
IC227  27512  [DIL28]
IC228  74HC244N  [DIL20]
IC229  74HC244N  [DIL20]
IC230  74HC244N  [DIL20]
IC231  74273N  [DIL20]
IC232  74LS27N  [DIL14]
IC233  74LS08N  [DIL14]
IC234  74LS04N  [DIL14]
IC235  74LS02N  [DIL14]
IC236  74S08N  [DIL14]
IC237  74S153N  [DIL16]
IC238  74LS04N  [DIL14]
IC239  74LS04N  [DIL14]
IC240  74LS08N  [DIL14]
IC241  74S153N  [DIL16]
IC242  74LS08N  [DIL14]
IC243  27512  [DIL28]
IC244  74LS08N  [DIL14]
IC245  74LS377N  [DIL20]
IC246  74LS04N  [DIL14]
IC247  74LS00N  [DIL14]
IC248  74LS04N  [DIL14]
IC249  74LS02N  [DIL14]
IC250  74273N  [DIL20]
IC251  74S32N  [DIL14]
IC252  74LS02N  [DIL14]
IC253  74LS04N  [DIL14]
IC254  74LS138N  [DIL16]
IC255  74S153N  [DIL16]
IC256  74LS257N  [DIL16]
IC257  27512  [DIL28]
IC260  74LS377N  [DIL20]
IC261  27512  [DIL28]
IC262  27512  [DIL28]
IC270  74S153N  [DIL16]
IC302  27512  [DIL28]
IC303  27512  [DIL28]
IC333  27512  [DIL28]
IC334  74273N  [DIL20]
IC335  27512  [DIL28]
IC336  74273N  [DIL20]
IC337  27512  [DIL28]
IC338  74273N  [DIL20]
IC339  27512  [DIL28]
IC341  74LS257N  [DIL16]
IC411  74279N  [DIL16]
IC412  74LS173N  [DIL16]
IC_02_0  7402N  [DIL14]
IC_04_2  74HC04N  [DIL14]
IC_10_0  74LS10N  [DIL14]
IC_86_0  74LS86N  [DIL14]
IC_86_1  74LS86N  [DIL14]
INT_CODE_REG1  74LS377N  [DIL20]
INT_STATUS_REG  74273N  [DIL20]
R1  R-US_0204/2V  [0204V]
R2  R-US_0204/2V  [0204V]
R3  R-US_0204/2V  [0204V]
R4  R-US_0204/2V  [0204V]
R5  R-US_0204/2V  [0204V]
R6  R-US_0204/2V  [0204V]
R7  R-US_0204/2V  [0204V]
R8  R-US_0204/2V  [0204V]
R9  R-US_0204/2V  [0204V]
R10  R-US_0204/2V  [0204V]
R11  R-US_0204/2V  [0204V]
R12  R-US_0204/2V  [0204V]
R13  R-US_0204/2V  [0204V]
R14  R-US_0204/2V  [0204V]
R15  R-US_0204/2V  [0204V]
R16  R-US_0204/2V  [0204V]
R17  R-US_0204/2V  [0204V]
R18  R-US_0204/2V  [0204V]
R19  R-US_0204/2V  [0204V]
R20  R-US_0204/2V  [0204V]
R21  R-US_0204/2V  [0204V]
R22  R-US_0204/2V  [0204V]
R23  R-US_0204/2V  [0204V]
R24  R-US_0204/2V  [0204V]
R25  R-US_0204/2V  [0204V]
R26  R-US_0204/2V  [0204V]
R27  R-US_0204/2V  [0204V]
R28  R-US_0204/2V  [0204V]
S5  TL36PO  [TL3XPO]
S7  TL36PO  [TL3XPO]
S8  TL36PO  [TL3XPO]
SW1  SW_DIP-8  [EDG-08]
SW2  SW_DIP-8  [EDG-08]
SW3  SW_DIP-8  [EDG-08]
SW4  SW_DIP-8  [EDG-08]
SW5  SW_DIP-8  [EDG-08]
U1  AS6C4008-55PCN  [DIP254P1524X393-32]
U2  AS6C4008-55PCN  [DIP254P1524X393-32]
U3  AS6C4008-55PCN  [DIP254P1524X393-32]
U4  AS6C4008-55PCN  [DIP254P1524X393-32]
U5  AS6C4008-55PCN  [DIP254P1524X393-32]
U6  AS6C4008-55PCN  [DIP254P1524X393-32]
U7  AS6C4008-55PCN  [DIP254P1524X393-32]
U8  AS6C4008-55PCN  [DIP254P1524X393-32]

## Nets
1: IC15.4(1Y) IC61.4(D0) IC153.5(B:I1) IC167.5(B:I1)
1KHZ: SW3.6
1MHZ: SW3.7
2: IC15.7(2Y) IC61.3(D1) IC167.4(B:I0)
2MHZ: SW3.8
3: IC15.9(3Y) IC59.4(B:I0) IC61.2(D2)
4: IC15.12(4Y) IC59.5(B:I1) IC61.1(D3)
10HZ: SW3.2
50HZ: SW3.3
200HZ: SW3.4
500HZ: SW3.5
2345: IC42.9(C) IC125.9(3Y)
234324: IC125.12(4Y) IC180.14(A)
423423: IC118.4(1Y) IC180.2(B)
A_WRT: IC165.1(G) IC171.1(G)
AD0: IC4.18(A:Y1)
AD1: IC4.16(A:Y2)
AD2: IC4.14(A:Y3)
AD3: IC4.12(A:Y4)
AD4: IC4.9(B:Y1)
AD5: IC4.7(B:Y2)
AD6: IC4.5(B:Y3)
AD7: IC4.3(B:Y4)
AD8: IC26.18(A:Y1)
AD9: IC26.16(A:Y2)
AD10: IC26.14(A:Y3)
AD11: IC26.12(A:Y4)
AD12: IC26.9(B:Y1)
AD13: IC26.7(B:Y2)
AD14: IC26.5(B:Y3)
AD15: IC26.3(B:Y4)
AD16: IC65.18(A:Y1)
AD17: IC65.16(A:Y2)
AD18: IC65.14(A:Y3)
AD19: IC65.12(A:Y4)
AD20: IC65.9(B:Y1)
AD21: IC65.7(B:Y2)
ADDR_13: IC214.1(A)
ADDR_14: IC214.2(B)
ADDR_15: IC232.5(B:I2) IC246.13(F:I)
ADDRESS_BUS0: IC207.2(A:A1) IC223.18(A:Y1)
ADDRESS_BUS1: IC207.4(A:A2) IC223.16(A:Y2)
ADDRESS_BUS2: IC207.6(A:A3)
ADDRESS_BUS3: IC207.8(A:A4)
ADDRESS_BUS4: IC207.11(B:A1)
ADDRESS_BUS5: IC207.13(B:A2)
ADDRESS_BUS6: IC207.15(B:A3)
ADDRESS_BUS7: IC207.17(B:A4)
ADDRESS_BUS8: IC209.2(A:A1)
ADDRESS_BUS9: IC209.4(A:A2)
ADDRESS_BUS10: IC209.6(A:A3)
ADDRESS_BUS11: IC209.8(A:A4)
ADDRESS_BUS12: IC209.11(B:A1)
ADDRESS_BUS13: IC209.13(B:A2)
ADDRESS_BUS14: IC209.15(B:A3)
ADDRESS_BUS15: IC209.17(B:A4)
ADDRESS_BUS16: IC211.2(A:A1)
ADDRESS_BUS17: IC211.4(A:A2)
ADDRESS_BUS18: IC211.6(A:A3)
ADDRESS_BUS19: IC164.3(C) IC211.8(A:A4)
ADDRESS_BUS20: IC164.2(B) IC211.11(B:A1)
ADDRESS_BUS21: IC164.1(A) IC211.13(B:A2) IC229.16(A:Y2)
AH_0: IC3.3(D1)
AH_1: IC6.3(D1)
AH_2: IC41.3(D1)
AH_3: IC56.3(D1)
AH_4: IC68.3(D1)
AH_5: IC81.3(D1)
AH_6: IC85.3(D1)
AH_7: IC88.3(D1)
AL_0: IC3.4(D0)
AL_1: IC6.4(D0)
AL_2: IC41.4(D0)
AL_3: IC56.4(D0)
AL_4: IC68.4(D0)
AL_5: IC81.4(D0)
AL_6: IC85.4(D0)
AL_7: IC88.4(D0)
ALU_A_SRC_0: IC125.3(1B)
ALU_A_SRC_1: IC125.6(2B)
ALU_A_SRC_2: IC125.10(3B)
ALU_A_SRC_3: IC83.14(A) IC125.13(4B)
ALU_A_SRC_4: IC83.2(B) IC118.3(1B)
ALU_A_SRC_5: IC1.1(!A!/B) IC13.1(!A!/B)
ALU_B_SRC_0: IC92.14(A)
ALU_B_SRC_1: IC92.2(B)
ALU_B_SRC_2: IC98.1(!A!/B) IC122.1(!A!/B)
ALU_CF: IC11.16(CN+4) IC_86_0.5(B:I1)
ALU_CF_IN_INVERT: IC_86_0.2(A:I1)
ALU_CF_IN_SRC_0: IC47.14(A)
ALU_CF_IN_SRC_1: IC47.2(B)
ALU_CF_OUT_INVERT: IC_86_0.4(B:I0)
ALU_FINAL_CF: IC14.3(D1) IC270.5(1C1) IC_86_0.6(B:O)
ALU_MODE: IC10.8(M) IC11.8(M)
ALU_OF: IC23.3(D1) IC127.3(1B) IC_04_2.4(B:O)
ALU_OP0: IC10.6(S0) IC11.6(S0) IC_10_0.1(A:I0)
ALU_OP1: IC10.5(S1) IC11.5(S1) IC_02_0.3(A:I1)
ALU_OP2: IC10.4(S2) IC11.4(S2) IC_02_0.2(A:I0)
ALU_OP3: IC10.3(S3) IC11.3(S3) IC_10_0.2(A:I1)
ALU_OUTPUT_0: IC10.9(F0) IC14.2(D2) IC16.1(D3) IC91.6(1C0) IC91.12(2C2) IC270.4(1C2)
ALU_OUTPUT_1: IC10.10(F1) IC91.5(1C1) IC91.10(2C0) IC95.4(1C2)
ALU_OUTPUT_2: IC10.11(F2) IC91.11(2C1) IC95.6(1C0) IC95.12(2C2)
ALU_OUTPUT_3: IC10.13(F3) IC95.5(1C1) IC95.10(2C0) IC111.4(1C2)
ALU_OUTPUT_4: IC11.9(F0) IC95.11(2C1) IC111.6(1C0) IC111.12(2C2)
ALU_OUTPUT_5: IC11.10(F1) IC111.5(1C1) IC111.10(2C0) IC113.4(1C2)
ALU_OUTPUT_6: IC11.11(F2) IC111.11(2C1) IC113.6(1C0) IC113.12(2C2)
ALU_OUTPUT_7: IC11.13(F3) IC14.15(D4) IC16.15(D4) IC91.3(1C3) IC91.13(2C3) IC95.3(1C3) IC95.13(2C3) IC111.3(1C3) IC111.13(2C3) IC113.3(1C3) IC113.5(1C1) IC113.10(2C0) IC113.13(2C3) IC270.3(1C3)
ALU_ZF: IC58.3(B:I0) IC58.12(A:O) IC236.1(A:I0) IC237.5(1C1) IC241.5(1C1)
ANY_INTERRUPTION: IC18.6(B:O) IC119.2(A:I1)
B_WRT: IC166.1(G)
BH_0: IC3.1(D3)
BH_1: IC6.1(D3)
BH_2: IC41.1(D3)
BH_3: IC56.1(D3)
BH_4: IC68.1(D3)
BH_5: IC81.1(D3)
BH_6: IC85.1(D3)
BH_7: IC88.1(D3)
BIOS_CONFIG: IC254.7(Y7)
BL_0: IC3.2(D2)
BL_1: IC6.2(D2)
BL_2: IC41.2(D2)
BL_3: IC56.2(D2)
BL_4: IC68.2(D2)
BL_5: IC81.2(D2)
BL_6: IC85.2(D2)
BL_7: IC88.2(D2)
BP_H_0: IC2.1(D3)
BP_H_1: IC20.1(D3)
BP_H_2: IC44.1(D3)
BP_H_3: IC62.1(D3)
BP_H_4: IC69.1(D3)
BP_H_5: IC82.1(D3)
BP_H_6: IC86.1(D3)
BP_H_7: IC89.1(D3)
BP_L_0: IC2.2(D2)
BP_L_1: IC20.2(D2)
BP_L_2: IC44.2(D2)
BP_L_3: IC62.2(D2)
BP_L_4: IC69.2(D2)
BP_L_5: IC82.2(D2)
BP_L_6: IC86.2(D2)
BP_L_7: IC89.2(D2)
BPH_WRT: IC123.1(G)
BPL_WRT: IC117.1(G)
BUFFER_MEM_IO: IC161.14(A:Y3) IC164.4(G2A) IC164.5(G2B) IC168.1(A:I0) IC205.5(C:I) IC214.6(G1) IC_10_0.11(C:I2)
BUFFER_RD: IC161.18(A:Y1) IC187.24(!OE) IC188.22(!OE) IC208.1(DIR) U1.24(OE) U2.24(OE) U3.24(OE) U4.24(OE) U5.24(OE) U6.24(OE) U7.24(OE) U8.24(OE)
BUFFER_WR: IC161.16(A:Y2) IC187.29(!WE) U1.29(WE) U2.29(WE) U3.29(WE) U4.29(WE) U5.29(WE) U6.29(WE) U7.29(WE) U8.29(WE)
BUS_MEM_IO: IC27.14(A:Y3) IC161.6(A:A3)
BUS_RD: IC27.18(A:Y1) IC150.18(A:Y1) IC161.2(A:A1)
BUS_TRISTATE: IC4.1(A:G) IC4.19(B:G) IC26.1(A:G) IC26.19(B:G) IC65.1(A:G) IC65.19(B:G) IC72.1(A:G) IC90.1(!A!/B) IC150.1(A:G) IC151.6(B:O) IC154.9(D:I) IC174.6(B:O) IC176.9(D:I) IC195.1(!A!/B) IC202.1(A:I0)
BUS_WR: IC27.16(A:Y2) IC150.16(A:Y2) IC161.4(A:A2)
CF_IN_SRC_0: IC14.11(A)
CF_IN_SRC_1: IC14.10(B)
CF_IN_SRC_2: IC14.9(C)
CH_0: IC3.14(D5)
CH_1: IC6.14(D5)
CH_2: IC41.14(D5)
CH_3: IC56.14(D5)
CH_4: IC68.14(D5)
CH_5: IC81.14(D5)
CH_6: IC85.14(D5)
CH_7: IC88.14(D5)
CL_0: IC3.15(D4)
CL_1: IC6.15(D4)
CL_2: IC41.15(D4)
CL_3: IC56.15(D4)
CL_4: IC68.15(D4)
CL_5: IC81.15(D4)
CL_6: IC85.15(D4)
CL_7: IC88.15(D4)
CLEAR_ALL_INTS: IC196.3(B:I)
CLK: IC8.11(CLK) IC99.11(CLK) IC120.18(A:Y1) IC190.3(A:CLK) IC190.11(B:CLK)
CLK_2.5HZ: IC189.13(Q8) SW3.1
CLK_5MHZ: IC186.10(P1)
CLK_640HZ: IC189.9(Q1)
CLK_1280HZ: IC186.1(Q12) IC189.10(P1)
CLK_CRYSTAL: IC115.4(B:O) IC412.14(D1) SW1.2
COND_FLAG_SRC: IC15.1(!A!/B)
COND_INVERT: IC175.4(B:I0)
COND_SEL_0: IC12.11(A) IC61.11(A)
COND_SEL_1: IC12.10(B) IC61.10(B)
COND_SEL_2: IC12.9(C) IC61.9(C)
COND_SEL_3: IC341.1(!A!/B)
CONDITION: IC175.5(B:I1) IC341.4(1Y)
D_WRT: IC210.1(G)
DATA0: IC28.3(1D)
DATA1: IC28.4(2D)
DATA2: IC28.7(3D)
DATA3: IC28.8(4D)
DATA4: IC28.13(5D)
DATA5: IC28.14(6D)
DATA6: IC28.17(7D)
DATA7: IC28.18(8D)
DATA_BUS0: IC7.3(1B) IC54.4(1Y) IC187.13(I/O1) IC188.11(O0) IC208.2(A1) IC208.18(B1) IC219.18(A:Y1)
DATA_BUS1: IC7.6(2B) IC54.7(2Y) IC187.14(I/O2) IC188.12(O1) IC208.3(A2) IC208.17(B2)
DATA_BUS2: IC7.10(3B) IC54.9(3Y) IC187.15(I/O3) IC188.13(O2) IC208.4(A3) IC208.16(B3)
DATA_BUS3: IC7.13(4B) IC54.12(4Y) IC187.17(I/O4) IC188.15(O3) IC208.5(A4) IC208.15(B4)
DATA_BUS4: IC24.3(1B) IC96.4(1Y) IC187.18(I/O5) IC188.16(O4) IC208.6(A5) IC208.14(B5)
DATA_BUS5: IC24.6(2B) IC96.7(2Y) IC187.19(I/O6) IC188.17(O5) IC208.7(A6) IC208.13(B6)
DATA_BUS6: IC24.10(3B) IC96.9(3Y) IC187.20(I/O7) IC188.18(O6) IC208.8(A7) IC208.12(B7)
DATA_BUS7: IC24.13(4B) IC96.12(4Y) IC187.21(I/O8) IC188.19(O7) IC208.9(A8) IC208.11(B8) IC218.12(A:Y4)
DH_0: IC3.12(D7)
DH_1: IC6.12(D7)
DH_2: IC41.12(D7)
DH_3: IC56.12(D7)
DH_4: IC68.12(D7)
DH_5: IC81.12(D7)
DH_6: IC85.12(D7)
DH_7: IC88.12(D7)
DI_H_0: IC2.12(D7) IC109.2(1Q)
DI_H_1: IC20.12(D7) IC109.5(2Q)
DI_H_2: IC44.12(D7) IC109.6(3Q)
DI_H_3: IC62.12(D7) IC109.9(4Q)
DI_H_4: IC69.12(D7) IC109.12(5Q)
DI_H_5: IC82.12(D7) IC109.15(6Q)
DI_H_6: IC86.12(D7) IC109.16(7Q)
DI_H_7: IC89.12(D7) IC109.19(8Q)
DI_L_0: IC2.13(D6) IC110.2(1Q)
DI_L_1: IC20.13(D6) IC110.5(2Q)
DI_L_2: IC44.13(D6) IC110.6(3Q)
DI_L_3: IC62.13(D6) IC110.9(4Q)
DI_L_4: IC69.13(D6) IC110.12(5Q)
DI_L_5: IC82.13(D6) IC110.15(6Q)
DI_L_6: IC86.13(D6) IC110.16(7Q)
DI_L_7: IC89.13(D6) IC110.19(8Q)
DISPLAY_REG_LOAD: IC197.3(B:I) IC202.13(A:I2)
DL_0: IC3.13(D6)
DL_1: IC6.13(D6)
DL_2: IC41.13(D6)
DL_3: IC56.13(D6)
DL_4: IC68.13(D6)
DL_5: IC81.13(D6)
DL_6: IC85.13(D6)
DL_7: IC88.13(D6)
DMA_REQ: IC18.5(B:I1) IC61.12(D7) IC190.5(A:Q)
EXT_INPUT: IC12.1(D3) IC190.9(B:Q)
FINAL_CONDITION: IC43.3(B:I) IC175.6(B:O)
FORCE_USER_PTB: IC18.9(C:I0)
GND: IC12.7(G) IC14.12(D7) IC14.13(D6) IC14.14(D5) IC15.15(G) IC16.4(D0) IC16.7(G) IC17.1(A:G) IC17.19(B:G) IC18.1(A:I0) IC21.1(A14) IC21.20(!CE) IC21.26(A13) IC23.12(D7) IC23.13(D6) IC23.14(D5) IC25.11(C:I2) IC34.5(1C1) IC34.11(2C1) IC35.5(1C1) IC35.11(2C1) IC36.5(1C1) IC36.11(2C1) IC39.2(1A) IC39.5(2A) IC39.11(3A) IC39.15(G) IC46.11(B4) IC46.12(A4) IC46.14(A3) IC46.15(B3) IC47.1(1G) IC47.3(1C3) IC47.10(2C0) IC47.11(2C1) IC47.12(2C2) IC47.13(2C3) IC47.15(2G) IC49.5(2A) IC49.11(3A) IC49.14(4A) IC49.15(G) IC50.7(C0) IC55.2(1A) IC55.5(2A) IC55.11(3A) IC55.14(4A) IC55.15(G) IC61.7(G) IC63.2(1A) IC63.5(2A) IC63.11(3A) IC63.14(4A) IC63.15(G) IC100.2(1A) IC100.5(2A) IC100.10(3B) IC100.11(3A) IC100.13(4B) IC100.14(4A) IC100.15(G) IC104.11(3A) IC104.14(4A) IC104.15(G) IC105.5(EI) IC112.5(2A) IC112.11(3A) IC112.14(4A) IC112.15(G) IC114.15(G) IC120.1(A:G) IC140.1(A14) IC140.20(!CE) IC140.26(A13) IC142.2(1A) IC142.5(2A) IC142.11(3A) IC142.14(4A) IC147.2(1A) IC147.5(2A) IC147.11(3A) IC147.14(4A) IC149.4(G2A) IC149.5(G2B) IC163.1(A:G) IC163.19(B:G) IC186.11(RES) IC187.2(A16) IC187.31(A15) IC188.1(A15) IC189.11(RES) IC202.2(A:I1) IC206.15(G) IC208.19(G) IC214.3(C) IC214.4(G2A) IC214.5(G2B) IC237.3(1C3) IC255.4(1C2) IC255.10(2C0) IC255.11(2C1) IC255.12(2C2) IC255.13(2C3) IC412.1(M) IC412.2(N) INT_CODE_REG1.3(1D) INT_CODE_REG1.13(5D) INT_CODE_REG1.14(6D) INT_CODE_REG1.17(7D) INT_CODE_REG1.18(8D) S5.2(P) S7.2(P) S8.2(P) SW2.1 SW2.2 SW2.3 SW2.4 SW2.5 SW2.6 SW2.7 SW2.8 SW4.9 SW4.10 SW4.11 SW4.12 SW4.13 SW4.14 SW4.15 SW4.16 SW5.1 SW5.2 SW5.3 SW5.4 SW5.5 SW5.6 SW5.7 SW5.8
IDE: IC254.10(Y5)
IMMY_0: IC98.2(1A) IC256.3(1B)
IMMY_1: IC98.5(2A) IC256.6(2B)
IMMY_2: IC98.11(3A)
IMMY_3: IC98.14(4A)
IMMY_4: IC122.2(1A)
IMMY_5: IC122.5(2A)
IMMY_6: IC122.11(3A)
IMMY_7: IC122.14(4A)
INT_0: R1.1 SW2.16
INT_1: R4.1 SW2.15
INT_2: R5.1 SW2.14
INT_3: R14.1 SW2.13
INT_4: R25.1 SW2.12
INT_5: R22.1 SW2.11
INT_6: R27.1 SW2.10
INT_7: R28.1 SW2.9
INT_MASKS_0: IC8.2(1Q) IC42.1(D3) IC139.1(A:I0)
INT_MASKS_1: IC8.5(2Q) IC80.1(D3) IC139.4(B:I0)
INT_MASKS_2: IC8.6(3Q) IC130.1(D3) IC139.9(C:I0)
INT_MASKS_3: IC8.9(4Q) IC133.1(D3) IC139.12(D:I0)
INT_MASKS_4: IC8.12(5Q) IC141.1(D3) IC148.1(A:I0)
INT_MASKS_5: IC8.15(6Q) IC144.1(D3) IC148.4(B:I0)
INT_MASKS_6: IC8.16(7Q) IC148.9(C:I0) IC152.1(D3)
INT_MASKS_7: IC8.19(8Q) IC148.12(D:I0) IC160.1(D3)
INT_MASKS_WRT: IC8.1(G)
INT_PENDING: IC12.2(D2) IC18.2(A:I1) IC22.3(A:O)
INT_REQ_0: IC74.3(A:CLK)
INT_REQ_1: IC74.11(B:CLK)
INT_REQ_2: IC107.3(A:CLK)
INT_REQ_3: IC107.11(B:CLK)
INT_REQ_4: IC108.3(A:CLK)
INT_REQ_5: IC108.11(B:CLK)
INT_REQ_6: IC137.3(A:CLK)
INT_REQ_7: IC137.11(B:CLK)
INT_REQUEST: IC22.1(A:I0) IC105.15(EO)
INT_STATUS_0: IC42.15(D4) IC139.2(A:I1) INT_STATUS_REG.2(Q1)
INT_STATUS_1: IC80.15(D4) IC139.5(B:I1) INT_STATUS_REG.5(Q2)
INT_STATUS_2: IC130.15(D4) IC139.10(C:I1) INT_STATUS_REG.6(Q3)
INT_STATUS_3: IC133.15(D4) IC139.13(D:I1) INT_STATUS_REG.9(Q4)
INT_STATUS_4: IC141.15(D4) IC148.2(A:I1) INT_STATUS_REG.12(Q5)
INT_STATUS_5: IC144.15(D4) IC148.5(B:I1) INT_STATUS_REG.15(Q6)
INT_STATUS_6: IC148.10(C:I1) IC152.15(D4) INT_STATUS_REG.16(Q7)
INT_STATUS_7: IC148.13(D:I1) IC160.15(D4) INT_STATUS_REG.19(Q8)
INT_VECTOR_0: IC42.2(D2) INT_CODE_REG1.2(1Q)
INT_VECTOR_1: IC80.2(D2) IC149.1(A) INT_CODE_REG1.5(2Q)
INT_VECTOR_2: IC130.2(D2) IC149.2(B) INT_CODE_REG1.6(3Q)
INT_VECTOR_3: IC133.2(D2) IC149.3(C) INT_CODE_REG1.9(4Q)
INT_VECTOR_4: IC141.2(D2) INT_CODE_REG1.12(5Q)
INT_VECTOR_5: IC144.2(D2) INT_CODE_REG1.15(6Q)
INT_VECTOR_6: IC152.2(D2) INT_CODE_REG1.16(7Q)
INT_VECTOR_7: IC160.2(D2) INT_CODE_REG1.19(8Q)
INT_VECTOR_WRT: INT_CODE_REG1.1(G)
IR_0: IC28.2(1Q) IC37.5(1C1)
IR_1: IC28.5(2Q) IC37.11(2C1)
IR_2: IC28.6(3Q) IC38.5(1C1)
IR_3: IC28.9(4Q) IC38.11(2C1)
IR_4: IC28.12(5Q) IC40.5(1C1)
IR_5: IC28.15(6Q) IC40.11(2C1)
IR_6: IC28.16(7Q) IC73.5(1C1)
IR_7: IC28.19(8Q) IC73.11(2C1)
IR_WRT: IC28.1(G)
KBUS0: IC92.7(1Y) IC98.3(1B)
KBUS1: IC92.9(2Y) IC98.6(2B)
KBUS2: IC98.10(3B) IC103.7(1Y)
KBUS3: IC98.13(4B) IC103.9(2Y)
KBUS4: IC116.7(1Y) IC122.3(1B)
KBUS5: IC116.9(2Y) IC122.6(2B)
KBUS6: IC122.10(3B) IC124.7(1Y)
KBUS7: IC122.13(4B) IC124.9(2Y)
KSP_H_0: IC42.3(D1) IC177.2(1Q)
KSP_H_1: IC80.3(D1) IC177.5(2Q)
KSP_H_2: IC130.3(D1) IC177.6(3Q)
KSP_H_3: IC133.3(D1) IC177.9(4Q)
KSP_H_4: IC141.3(D1) IC177.12(5Q)
KSP_H_5: IC144.3(D1) IC177.15(6Q)
KSP_H_6: IC152.3(D1) IC177.16(7Q)
KSP_H_7: IC160.3(D1) IC177.19(8Q)
KSP_H_WRT: IC177.1(G)
KSP_L_0: IC42.4(D0) IC178.2(1Q)
KSP_L_1: IC80.4(D0) IC178.5(2Q)
KSP_L_2: IC130.4(D0) IC178.6(3Q)
KSP_L_3: IC133.4(D0) IC178.9(4Q)
KSP_L_4: IC141.4(D0) IC178.12(5Q)
KSP_L_5: IC144.4(D0) IC178.15(6Q)
KSP_L_6: IC152.4(D0) IC178.16(7Q)
KSP_L_7: IC160.4(D0) IC178.19(8Q)
KSP_L_WRT: IC178.1(G)
MAR_H_0: IC9.1(D3) IC26.2(A:A1) IC57.2(1Q)
MAR_H_1: IC5.1(D3) IC26.4(A:A2) IC57.5(2Q)
MAR_H_2: IC26.6(A:A3) IC30.1(D3) IC57.6(3Q)
MAR_H_3: IC21.10(A0) IC53.1(D3) IC57.9(4Q) IC114.2(1A) IC140.10(A0)
MAR_H_4: IC21.9(A1) IC57.12(5Q) IC67.1(D3) IC114.5(2A) IC140.9(A1)
MAR_H_5: IC21.8(A2) IC57.15(6Q) IC71.1(D3) IC114.11(3A) IC140.8(A2)
MAR_H_6: IC21.7(A3) IC57.16(7Q) IC84.1(D3) IC114.14(4A) IC140.7(A3)
MAR_H_7: IC21.6(A4) IC57.19(8Q) IC87.1(D3) IC112.2(1A) IC140.6(A4)
MAR_IN_SRC: IC128.1(!A!/B) IC129.1(!A!/B) IC131.1(!A!/B) IC132.1(!A!/B)
MAR_L_0: IC4.2(A:A1) IC9.2(D2) IC48.2(1Q)
MAR_L_1: IC4.4(A:A2) IC5.2(D2) IC48.5(2Q)
MAR_L_2: IC4.6(A:A3) IC30.2(D2) IC48.6(3Q)
MAR_L_3: IC4.8(A:A4) IC48.9(4Q) IC53.2(D2)
MAR_L_4: IC4.11(B:A1) IC48.12(5Q) IC67.2(D2)
MAR_L_5: IC4.13(B:A2) IC48.15(6Q) IC71.2(D2)
MAR_L_6: IC4.15(B:A3) IC48.16(7Q) IC84.2(D2)
MAR_L_7: IC4.17(B:A4) IC48.19(8Q) IC87.2(D2)
MARH_WRT: IC57.1(G)
MARL_WRT: IC48.1(G)
MDR_0_1: IC5.15(D4) IC19.5(2Q) IC54.5(2A) IC92.10(2C0) IC97.4(A:A2)
MDR_0_2: IC19.6(3Q) IC30.15(D4) IC54.11(3A) IC97.6(A:A3) IC103.6(1C0)
MDR_0_3: IC19.9(4Q) IC53.15(D4) IC54.14(4A) IC97.8(A:A4) IC103.10(2C0)
MDR_0_4: IC19.12(5Q) IC67.15(D4) IC96.2(1A) IC97.11(B:A1) IC116.6(1C0)
MDR_0_5: IC19.15(6Q) IC71.15(D4) IC96.5(2A) IC97.13(B:A2) IC116.10(2C0)
MDR_0_6: IC19.16(7Q) IC84.15(D4) IC96.11(3A) IC97.15(B:A3) IC124.6(1C0)
MDR_0_7: IC19.19(8Q) IC87.15(D4) IC96.14(4A) IC97.17(B:A4) IC124.10(2C0)
MDR_0_WRT: IC19.1(G)
MDR_1_1: IC5.14(D5) IC54.6(2B) IC92.11(2C1) IC183.5(2Q) IC185.4(A:A2)
MDR_1_2: IC30.14(D5) IC54.10(3B) IC103.5(1C1) IC183.6(3Q) IC185.6(A:A3)
MDR_1_3: IC53.14(D5) IC54.13(4B) IC103.11(2C1) IC183.9(4Q) IC185.8(A:A4)
MDR_1_4: IC67.14(D5) IC96.3(1B) IC116.5(1C1) IC183.12(5Q) IC185.11(B:A1)
MDR_1_5: IC71.14(D5) IC96.6(2B) IC116.11(2C1) IC183.15(6Q) IC185.13(B:A2)
MDR_1_6: IC84.14(D5) IC96.10(3B) IC124.5(1C1) IC183.16(7Q) IC185.15(B:A3)
MDR_1_7: IC87.14(D5) IC96.13(4B) IC124.11(2C1) IC183.19(8Q) IC185.17(B:A4)
MDR_1_WRT: IC183.1(G)
MDR_DATA_OUT: IC43.5(C:I)
MDR_DATA_OUT_SRC: IC54.1(!A!/B) IC96.1(!A!/B)
MDR_H_0: IC9.14(D5) IC54.3(1B) IC92.5(1C1) IC183.2(1Q) IC185.2(A:A1)
MDR_IN_BUS8: IC7.4(1Y) IC19.3(1D) IC183.3(1D)
MDR_IN_BUS9: IC7.7(2Y) IC19.4(2D) IC183.4(2D)
MDR_IN_BUS10: IC7.9(3Y) IC19.7(3D) IC183.7(3D)
MDR_IN_BUS11: IC7.12(4Y) IC19.8(4D) IC183.8(4D)
MDR_IN_BUS12: IC19.13(5D) IC24.4(1Y) IC183.13(5D)
MDR_IN_BUS13: IC19.14(6D) IC24.7(2Y) IC183.14(6D)
MDR_IN_BUS14: IC19.17(7D) IC24.9(3Y) IC183.17(7D)
MDR_IN_BUS15: IC19.18(8D) IC24.12(4Y) IC183.18(8D)
MDR_IN_SRC: IC7.1(!A!/B) IC24.1(!A!/B)
MDR_L_0: IC9.15(D4) IC19.2(1Q) IC54.2(1A) IC92.6(1C0) IC97.2(A:A1)
MDR_TO_PAGETABLE_DATA_BUFFER: IC21.22(!OE) IC115.9(D:I) IC140.22(!OE)
MEM_SELECT_0: IC164.15(Y0) U1.22(CE)
MEM_SELECT_1: IC164.14(Y1) U2.22(CE) U3.22(CE) U4.22(CE) U5.22(CE) U6.22(CE) U7.22(CE) U8.22(CE)
MEM_SELECT_2: IC164.13(Y2)
MEM_SELECT_3: IC164.12(Y3)
MEM_SELECT_4: IC164.11(Y4)
MEM_SELECT_5: IC164.10(Y5)
MEM_SELECT_6: IC164.9(Y6)
MEM_SELECT_7: IC164.7(Y7)
MEMORY_IO: IC65.5(B:Y3)
MSW_12: FLAGS.12(Q5) IC181.6(1C0) IC206.2(1A)
MSW_13: FLAGS.15(Q6) IC181.10(2C0) IC206.5(2A)
MSW_14: FLAGS.16(Q7) IC99.16(7Q) IC206.11(3A)
MSW_15: FLAGS.19(Q8) IC206.14(4A)
MSW_CF: FLAGS.5(Q2) IC14.4(D0) IC15.5(2A) IC16.2(D2) IC47.5(1C1)
MSW_CPU_MODE: IC12.4(D0) IC18.10(C:I1) IC99.6(3Q)
MSW_DIR: IC12.15(D4) IC99.19(8Q)
MSW_DISPLAY_REG_LOAD: IC12.14(D5) IC99.15(6Q)
MSW_DMA_ACK: IC99.2(1Q) IC151.4(B:I0) IC174.4(B:I0)
MSW_H_WRT: IC206.1(!A!/B)
MSW_HALT: IC99.12(5Q) IC151.5(B:I1) IC174.5(B:I1)
MSW_INTERRUPT_ENABLE: IC22.2(A:I1) IC99.5(2Q)
MSW_L_WRT: IC99.1(G)
MSW_OF: FLAGS.9(Q4) IC15.14(4A) IC23.4(D0)
MSW_PAGING_EN: IC39.1(!A!/B) IC99.9(4Q) IC104.1(!A!/B) IC112.1(!A!/B) IC114.1(!A!/B)
MSW_SF: FLAGS.6(Q3) IC15.11(3A) IC255.6(1C0)
MSW_ZF: FLAGS.2(Q1) IC15.2(1A) IC58.5(B:I2) IC241.6(1C0)
MUX_A: IC45.3(A:O)
MUX_B: IC93.3(A:O)
N$1: IC1.3(1B) IC170.7(1Y)
N$2: IC29.6(1C0) IC41.5(Y)
N$3: IC29.5(1C1) IC44.5(Y)
N$4: IC45.2(A:I1) IC94.6(B:O)
N$5: IC74.5(A:Q) INT_STATUS_REG.3(D1)
N$6: IC143.2(A:I1) IC149.15(Y0)
N$7: IC42.5(Y) IC180.3(1C3)
N$8: IC10.7(CN) IC_86_0.3(A:O)
N$9: IC115.1(A:I) IC412.7(CLK) SW3.9 SW3.10 SW3.11 SW3.12 SW3.13 SW3.14 SW3.15 SW3.16
N$10: IC80.5(Y) IC180.13(2C3)
N$11: IC46.7(C0) IC52.9(C4)
N$12: IC49.4(1Y) IC50.6(B1)
N$13: IC29.3(1C3) IC130.5(Y)
N$14: IC49.7(2Y) IC50.2(B2)
N$15: IC47.7(1Y) IC_86_0.1(A:I0)
N$16: IC149.6(G1)
N$17: IC48.3(1D) IC131.4(1Y)
N$18: IC48.4(2D) IC131.7(2Y)
N$19: IC48.7(3D) IC131.9(3Y)
N$20: IC25.12(A:O) IC58.1(A:I0)
N$21: IC25.6(B:O) IC58.2(A:I1)
N$22: IC16.5(Y) IC91.4(1C2) IC113.11(2C1)
N$23: IC29.13(2C3) IC133.5(Y)
N$24: IC64.3(1C3) IC141.5(Y)
N$25: IC29.4(1C2) IC30.5(Y)
N$26: IC25.8(C:O) IC58.13(A:I2)
N$27: IC90.15(G) IC195.15(G)
N$28: IC90.3(1B) IC163.18(A:Y1)
N$29: IC48.8(4D) IC131.12(4Y)
N$30: IC42.11(A) IC125.4(1Y)
N$31: IC42.10(B) IC125.7(2Y)
N$32: IC48.13(5D) IC128.4(1Y)
N$33: IC26.8(A:A4) IC114.4(1Y)
N$34: IC64.13(2C3) IC144.5(Y)
N$35: IC49.9(3Y) IC50.15(B3)
N$36: IC49.12(4Y) IC50.11(B4)
N$37: IC51.6(B1) IC55.4(1Y)
N$38: IC51.2(B2) IC55.7(2Y)
N$39: IC51.15(B3) IC55.9(3Y)
N$40: IC51.11(B4) IC55.12(4Y)
N$41: FLAGS.3(D1) IC241.7(1Y)
N$42: IC10.16(CN+4) IC11.7(CN)
N$43: IC17.2(A:A1) IC91.7(1Y)
N$44: IC26.11(B:A1) IC114.7(2Y)
N$45: IC26.13(B:A2) IC114.9(3Y)
N$46: IC17.4(A:A2) IC91.9(2Y)
N$47: IC17.6(A:A3) IC95.7(1Y)
N$48: IC17.8(A:A4) IC95.9(2Y)
N$49: IC29.10(2C0) IC56.5(Y)
N$50: IC83.3(1C3) IC152.5(Y)
N$51: IC17.11(B:A1) IC111.7(1Y)
N$52: IC21.11(I/O0) IC39.3(1B) IC185.18(A:Y1)
N$53: IC21.12(I/O1) IC39.6(2B) IC185.16(A:Y2)
N$54: IC21.13(I/O2) IC39.10(3B) IC185.14(A:Y3)
N$55: IC21.15(I/O3) IC39.13(4B) IC185.12(A:Y4)
N$56: IC97.9(B:Y1) IC112.3(1B) IC140.16(I/O4)
N$57: IC97.7(B:Y2) IC112.6(2B) IC140.17(I/O5)
N$58: IC97.5(B:Y3) IC112.10(3B) IC140.18(I/O6)
N$59: IC97.3(B:Y4) IC112.13(4B) IC140.19(I/O7)
N$60: IC70.18(A:Y1)
N$61: IC70.16(A:Y2)
N$62: IC70.14(A:Y3)
N$63: IC70.12(A:Y4)
N$64: IC70.9(B:Y1)
N$65: IC52.6(B1) IC63.4(1Y)
N$66: IC74.1(A:CLR) IC143.3(A:O)
N$67: IC70.7(B:Y2)
N$68: IC70.5(B:Y3)
N$69: IC70.3(B:Y4)
N$70: IC23.15(D4) IC_86_0.8(C:O)
N$71: IC_04_2.1(A:I) IC_86_1.8(C:O)
N$72: IC_10_0.3(B:I0) IC_86_1.3(A:O)
N$73: IC_86_1.6(B:O) IC_86_1.10(C:I1)
N$74: IC52.2(B2) IC63.7(2Y)
N$75: IC52.15(B3) IC63.9(3Y)
N$76: IC29.11(2C1) IC62.5(Y)
N$77: IC75.3(D1) IC227.11(O0)
N$78: IC32.3(D1) IC34.7(1Y)
N$79: IC46.6(B1) IC100.4(1Y)
N$80: IC43.4(B:O) IC145.13(A:I2)
N$81: IC6.5(Y) IC180.10(2C0)
N$82: IC_10_0.12(A:O) IC_86_1.9(C:I0)
N$83: IC17.13(B:A2) IC111.9(2Y)
N$84: IC83.13(2C3) IC160.5(Y)
N$85: IC_04_2.2(A:O) IC_10_0.5(B:I2)
N$86: IC61.13(D6) IC167.6(B:O)
N$87: IC_02_0.1(A:O) IC_10_0.13(A:I2)
N$88: FLAGS.4(D2) IC14.5(Y)
N$89: IC1.6(2B) IC170.9(2Y)
N$90: FLAGS.7(D3) IC255.7(1Y)
N$91: IC20.5(Y) IC180.11(2C1)
N$92: FLAGS.8(D4) IC23.5(Y)
N$93: IC61.14(D5) IC153.6(B:O)
N$94: IC94.5(B:I1) IC119.3(A:O)
N$95: IC26.15(B:A3) IC114.12(4Y)
N$96: IC231.3(D1) IC237.7(1Y)
N$97: IC46.2(B2) IC100.7(2Y)
N$98: IC231.4(D2) IC270.7(1Y)
N$99: IC236.3(A:O) IC237.4(1C2)
N$100: IC127.4(1Y) IC231.8(D4)
N$101: IC121.4(1Y) IC231.7(D3)
N$102: IC115.2(A:O) IC126.3(A:CLK)
N$103: IC_04_2.3(B:I) IC_10_0.6(B:O)
N$104: IC1.10(3B) IC179.7(1Y)
N$105: IC26.17(B:A4) IC112.4(1Y)
N$106: IC150.2(A:A1) IC155.8(D:O)
N$107: IC17.15(B:A3) IC113.7(1Y)
N$108: IC65.2(A:A1) IC112.7(2Y)
N$109: IC1.13(4B) IC179.9(2Y)
N$110: IC13.3(1B) IC181.7(1Y)
N$111: IC105.4 IC139.3(A:O)
N$112: IC65.4(A:A2) IC112.9(3Y)
N$113: IC150.4(A:A2) IC156.8(D:O)
N$114: IC5.5(Y) IC180.12(2C2)
N$115: IC48.14(6D) IC128.7(2Y)
N$116: IC48.17(7D) IC128.9(3Y)
N$117: IC48.18(8D) IC128.12(4Y)
N$118: IC57.3(1D) IC129.4(1Y)
N$119: IC29.12(2C2) IC53.5(Y)
N$120: IC64.6(1C0) IC68.5(Y)
N$121: IC64.5(1C1) IC69.5(Y)
N$122: IC64.4(1C2) IC67.5(Y)
N$123: IC64.10(2C0) IC81.5(Y)
N$124: IC64.11(2C1) IC82.5(Y)
N$125: IC64.12(2C2) IC71.5(Y)
N$126: IC83.6(1C0) IC85.5(Y)
N$127: IC83.5(1C1) IC86.5(Y)
N$128: IC83.4(1C2) IC84.5(Y)
N$129: IC83.10(2C0) IC88.5(Y)
N$130: IC32.4(D2) IC34.9(2Y)
N$131: IC173.6(B:O) IC201.1(A:I0)
N$132: IC17.17(B:A4) IC113.9(2Y)
N$133: IC83.11(2C1) IC89.5(Y)
N$134: IC13.6(2B) IC181.9(2Y)
N$135: IC65.6(A:A3) IC112.12(4Y)
N$136: IC39.4(1Y) IC65.8(A:A4)
N$137: IC13.10(3B) IC182.7(1Y)
N$138: IC13.13(4B) IC182.9(2Y)
N$139: IC173.12(A:O) IC201.2(A:I1)
N$140: IC205.2(A:O) IC_10_0.9(C:I0)
N$141: IC188.20(!CE) IC_10_0.8(C:O)
N$142: IC118.1(!A!/B) IC125.1(!A!/B) IC202.12(A:O)
N$143: IC168.6(A:O) IC187.22(!CE1)
N$144: IC52.11(B4) IC63.12(4Y)
N$145: IC83.12(2C2) IC87.5(Y)
N$146: IC168.2(A:I1) IC201.3(A:O) IC_10_0.10(C:I1)
N$147: IC201.5(B:I1) IC205.4(B:O)
N$148: IC187.9(A3) IC188.7(A3) IC207.12(A:Y4)
N$149: IC187.10(A2) IC188.8(A2) IC207.14(A:Y3)
N$150: IC187.11(A1) IC188.9(A1) IC207.16(A:Y2)
N$151: IC190.12(B:D) R3.1 SW5.11
N$152: IC49.1(!A!/B) IC55.1(!A!/B) IC63.1(!A!/B) IC100.1(!A!/B) IC145.12(A:O)
N$153: IC187.12(A0) IC188.10(A0) IC207.18(A:Y1)
N$154: IC43.2(A:O) IC145.2(A:I1)
N$155: IC39.7(2Y) IC65.11(B:A1)
N$156: IC187.5(A7) IC188.3(A7) IC203.12(I7) IC207.3(B:Y4)
N$157: IC187.6(A6) IC188.4(A6) IC207.5(B:Y3) IC254.3(C)
N$158: IC187.7(A5) IC188.5(A5) IC207.7(B:Y2) IC254.2(B)
N$159: IC187.8(A4) IC188.6(A4) IC207.9(B:Y1) IC254.1(A)
N$160: IC187.4(A12) IC188.2(A12) IC203.3(I2) IC209.9(B:Y1)
N$161: IC187.27(A8) IC188.25(A8) IC203.11(I6) IC209.18(A:Y1)
N$162: IC170.4(1C2) IC184.2(1Q)
N$163: IC43.6(C:O) IC54.15(G) IC96.15(G)
N$164: IC187.23(A10) IC188.21(A10) IC203.5(I4) IC209.14(A:Y3)
N$165: IC187.25(A11) IC188.23(A11) IC203.4(I3) IC209.12(A:Y4)
N$166: IC187.28(A13) IC188.26(A13) IC203.2(I1) IC209.7(B:Y2)
N$167: IC187.3(A14) IC188.27(A14) IC203.1(I0) IC209.5(B:Y3)
N$168: IC205.6(C:O) IC254.4(G2A) IC254.5(G2B)
N$169: IC173.13(A:I2) IC211.18(A:Y1)
N$170: IC173.2(A:I1) IC211.16(A:Y2)
N$171: IC173.1(A:I0) IC211.14(A:Y3)
N$172: IC173.5(B:I2) IC211.12(A:Y4)
N$173: IC43.8(D:O) IC93.2(A:I1) IC119.1(A:I0)
N$174: IC173.4(B:I1) IC211.9(B:Y1)
N$175: IC173.3(B:I0) IC211.7(B:Y2)
N$176: IC90.6(2B) IC163.16(A:Y2)
N$177: IC90.10(3B) IC163.14(A:Y3)
N$178: IC33.14(D6) IC73.9(2Y)
N$179: IC33.13(D5) IC73.7(1Y)
N$180: IC39.9(3Y) IC65.13(B:A2)
N$181: IC39.12(4Y) IC65.15(B:A3)
N$182: IC57.4(2D) IC129.7(2Y)
N$183: IC90.13(4B) IC163.12(A:Y4)
N$184: IC163.9(B:Y1) IC195.3(1B)
N$185: IC163.7(B:Y2) IC195.6(2B)
N$186: IC97.18(A:Y1) IC114.3(1B) IC140.11(I/O0)
N$187: IC97.16(A:Y2) IC114.6(2B) IC140.12(I/O1)
N$188: IC97.14(A:Y3) IC114.10(3B) IC140.13(I/O2)
N$189: IC163.5(B:Y3) IC195.10(3B)
N$190: IC97.12(A:Y4) IC114.13(4B) IC140.15(I/O3)
N$191: IC21.16(I/O4) IC104.3(1B) IC185.9(B:Y1)
N$192: IC21.17(I/O5) IC104.6(2B) IC185.7(B:Y2)
N$193: IC21.18(I/O6) IC104.10(3B) IC185.5(B:Y3)
N$194: IC21.19(I/O7) IC104.13(4B) IC185.3(B:Y4)
N$195: IC57.7(3D) IC129.9(3Y)
N$196: IC21.27(!WE) IC138.8(D:O) IC140.27(!WE)
N$197: IC163.3(B:Y4) IC195.13(4B)
N$198: IC90.2(1A) IC198.2(1Q)
N$199: IC90.5(2A) IC198.5(2Q)
N$200: IC90.11(3A) IC198.6(3Q)
N$201: IC90.14(4A) IC198.9(4Q)
N$202: IC97.1(A:G) IC97.19(B:G) IC115.8(D:O) IC185.1(A:G) IC185.19(B:G)
N$203: IC66.3(1D)
N$204: IC66.4(2D)
N$205: IC66.7(3D)
N$206: IC66.8(4D)
N$207: IC66.13(5D)
N$208: IC65.17(B:A4) IC104.4(1Y)
N$209: IC72.2(A:A1) IC104.7(2Y)
N$210: FLAGS.13(D5) IC206.4(1Y)
N$211: FLAGS.14(D6) IC206.7(2Y)
N$212: IC57.8(4D) IC129.12(4Y)
N$213: IC57.13(5D) IC132.4(1Y)
N$214: IC57.14(6D) IC132.7(2Y)
N$215: IC57.17(7D) IC132.9(3Y)
N$216: IC57.18(8D) IC132.12(4Y)
N$217: IC195.2(1A) IC198.12(5Q)
N$218: IC195.5(2A) IC198.15(6Q)
N$219: IC18.3(A:O) IC18.4(B:I0)
N$220: IC195.11(3A) IC198.16(7Q)
N$221: IC195.14(4A) IC198.19(8Q)
N$222: IC90.4(1Y)
N$223: IC190.2(A:D) R15.1 SW5.12
N$224: IC192.2(A:S1) IC192.3(A:S2) R16.1 S5.1(O)
N$225: IC192.1(A:R) R17.1 S5.3(S)
N$226: IC193.2(A:S1) IC193.3(A:S2) R18.1 S7.1(O)
N$227: IC66.14(6D)
N$228: R11.1 SW4.6
N$229: IC66.17(7D)
N$230: IC66.18(8D)
N$231: IC58.6(B:O) IC241.4(1C2)
N$232: R12.1 SW4.7
N$233: IC66.2(1Q) IC142.3(1B)
N$234: IC66.5(2Q) IC142.6(2B)
N$235: IC66.6(3Q) IC142.10(3B)
N$236: IC66.9(4Q) IC142.13(4B)
N$237: IC334.3(D1) IC335.11(O0)
N$238: IC66.12(5Q) IC147.3(1B)
N$239: IC334.4(D2) IC335.12(O1)
N$240: IC334.7(D3) IC335.13(O2)
N$241: IC334.8(D4) IC335.15(O3)
N$242: IC66.15(6Q) IC147.6(2B)
N$243: R13.1 SW4.8
N$244: IC193.1(A:R) R19.1 S7.3(S)
N$245: IC194.3(A:S2) R20.1 S8.1(O)
N$246: IC66.16(7Q) IC147.10(3B)
N$247: IC334.13(D5) IC335.16(O4)
N$248: IC334.14(D6) IC335.17(O5)
N$249: IC334.17(D7) IC335.18(O6)
N$250: IC66.19(8Q) IC147.13(4B)
N$251: IC334.18(D8) IC335.19(O7)
N$252: IC334.11(CLK)
N$253: IC336.3(D1) IC337.11(O0)
N$254: IC336.4(D2) IC337.12(O1)
N$255: IC336.7(D3) IC337.13(O2)
N$256: IC336.8(D4) IC337.15(O3)
N$257: IC336.13(D5) IC337.16(O4)
N$258: IC336.14(D6) IC337.17(O5)
N$259: IC336.17(D7) IC337.18(O6)
N$260: IC336.18(D8) IC337.19(O7)
N$261: IC336.11(CLK)
N$262: IC338.3(D1) IC339.11(O0)
N$263: IC338.4(D2) IC339.12(O1)
N$264: IC338.7(D3) IC339.13(O2)
N$265: IC338.8(D4) IC339.15(O3)
N$266: IC338.13(D5) IC339.16(O4)
N$267: IC338.14(D6) IC339.17(O5)
N$268: IC338.17(D7) IC339.18(O6)
N$269: IC338.18(D8) IC339.19(O7)
N$270: IC338.11(CLK)
N$271: IC21.5(A5) IC140.5(A5) IC142.4(1Y)
N$272: IC61.5(Y) IC341.2(1A)
N$273: IC12.5(Y) IC341.3(1B)
N$274: IC21.4(A6) IC140.4(A6) IC142.7(2Y)
N$275: IC21.3(A7) IC140.3(A7) IC142.9(3Y)
N$276: IC21.25(A8) IC140.25(A8) IC142.12(4Y)
N$277: IC21.24(A9) IC140.24(A9) IC147.4(1Y)
N$278: IC21.21(A10) IC140.21(A10) IC147.7(2Y)
N$279: IC21.23(A11) IC140.23(A11) IC147.9(3Y)
N$280: IC21.2(A12) IC140.2(A12) IC147.12(4Y)
N$281: IC194.1(A:R) R21.1 S8.3(S)
N$282: IC197.4(B:O) IC198.1(G)
N$283: IC90.7(2Y)
N$284: IC90.9(3Y)
N$285: IC90.12(4Y)
N$286: IC195.4(1Y)
N$287: IC195.7(2Y)
N$288: IC105.9(A0) INT_CODE_REG1.4(2D)
N$289: IC195.9(3Y)
N$290: IC195.12(4Y)
N$291: IC32.7(D3) IC35.7(1Y)
N$292: IC32.8(D4) IC35.9(2Y)
N$293: IC32.13(D5) IC36.7(1Y)
N$294: IC32.14(D6) IC36.9(2Y)
N$295: IC32.17(D7) IC37.7(1Y)
N$296: IC32.18(D8) IC37.9(2Y)
N$297: IC33.3(D1) IC38.7(1Y)
N$298: IC33.4(D2) IC38.9(2Y)
N$299: IC33.7(D3) IC40.7(1Y)
N$300: IC33.8(D4) IC40.9(2Y)
N$301: IC168.5(A:I3) IC201.4(B:I0) IC205.1(A:I) IC209.3(B:Y4)
N$302: IC187.26(A9) IC188.24(A9) IC203.6(I5) IC209.16(A:Y2)
N$303: IC201.6(B:O) IC254.6(G1)
N$304: IC170.12(2C2) IC184.5(2Q)
N$305: IC179.4(1C2) IC184.6(3Q)
N$306: IC179.12(2C2) IC184.9(4Q)
N$307: IC181.4(1C2) IC184.12(5Q)
N$308: IC181.12(2C2) IC184.15(6Q)
N$309: IC182.4(1C2) IC184.16(7Q)
N$310: IC182.12(2C2) IC184.19(8Q)
N$311: IC170.3(1C3) IC204.2(1Q)
N$312: IC170.13(2C3) IC204.5(2Q)
N$313: IC179.3(1C3) IC204.6(3Q)
N$314: IC179.13(2C3) IC204.9(4Q)
N$315: IC181.3(1C3) IC204.12(5Q)
N$316: IC181.13(2C3) IC204.15(6Q)
N$317: IC182.3(1C3) IC204.16(7Q)
N$318: IC182.13(2C3) IC204.19(8Q)
N$319: IC221.6(B:O) IC232.4(B:I1)
N$320: IC213.22(!CE1) IC232.6(B:O)
N$321: IC214.12(Y3) IC234.13(F:I) IC252.2(A:I0)
N$322: IC214.13(Y2) IC215.2(A:I0) IC238.13(F:I)
N$323: IC232.3(B:I0) IC244.3(A:O)
N$324: FLAGS.17(D7) IC206.9(3Y)
N$325: FLAGS.18(D8) IC206.12(4Y)
N$326: IC251.5(B:I1) IC252.1(A:O)
N$327: IC239.12(F:O) IC240.2(A:I1)
N$328: IC240.1(A:I0) IC249.3(A:I1) IC250.5(Q2)
N$329: IC238.12(F:O) IC242.2(A:I1)
N$330: IC215.3(A:I1) IC242.1(A:I0) IC250.6(Q3)
N$331: IC234.12(F:O) IC244.2(A:I1)
N$332: IC244.1(A:I0) IC250.9(Q4) IC252.3(A:I1)
N$333: IC50.5(A1)
N$334: IC50.3(A2)
N$335: IC50.14(A3)
N$336: IC50.12(A4)
N$337: IC52.5(A1)
N$338: IC51.5(A1)
N$339: IC51.3(A2)
N$340: IC51.14(A3)
N$341: IC51.12(A4)
N$342: IC221.5(B:I1) IC240.3(A:O)
N$343: IC221.4(B:I0) IC242.3(A:O)
N$344: IC212.20(!CE) IC247.3(A:O)
N$345: IC246.12(F:O) IC247.2(A:I1)
N$346: IC247.1(A:I0) IC248.12(F:O)
N$347: IC202.6(B:O) IC248.13(F:I)
N$348: IC199.20(!CE) IC199.22(!OE) IC227.20(!CE) IC227.22(!OE) IC243.20(!CE) IC243.22(!OE) IC257.20(!CE) IC257.22(!OE) IC261.20(!CE) IC261.22(!OE) IC262.20(!CE) IC262.22(!OE) IC302.20(!CE) IC302.22(!OE) IC303.20(!CE) IC303.22(!OE) IC333.20(!CE) IC333.22(!OE) IC335.20(!CE) IC335.22(!OE) IC337.20(!CE) IC337.22(!OE) IC339.20(!CE) IC339.22(!OE)
N$349: IC202.5(B:I2) IC249.1(A:O)
N$350: IC52.3(A2)
N$351: IC52.14(A3)
N$352: IC52.12(A4)
N$353: IC214.14(Y1) IC239.13(F:I) IC249.2(A:I0)
N$354: IC202.4(B:I1) IC215.1(A:O)
N$355: IC105.11 IC148.8(C:O)
N$356: IC202.3(B:I0) IC251.6(B:O)
N$357: IC50.9(C4) IC51.7(C0)
N$358: IC51.9(C4) IC52.7(C0)
N$359: IC214.15(Y0) IC253.13(F:I)
N$360: IC251.4(B:I0) IC253.12(F:O)
N$361: IC231.13(D5) IC256.4(1Y)
N$362: IC231.14(D6) IC256.7(2Y)
N$365: IC105.3 IC139.6(B:O)
N$367: IC75.4(D2) IC227.12(O1)
N$369: IC75.7(D3) IC227.13(O2)
N$372: IC107.13(B:CLR) IC143.11(D:O)
N$374: IC108.1(A:CLR) IC146.3(A:O)
N$375: IC75.8(D4) IC227.15(O3)
N$376: IC75.13(D5) IC227.16(O4)
N$377: IC75.14(D6) IC227.17(O5)
N$378: IC60.3(D1) IC333.11(O0)
N$379: IC60.4(D2) IC333.12(O1)
N$380: IC60.7(D3) IC333.13(O2)
N$381: IC60.8(D4) IC333.15(O3)
N$382: IC60.13(D5) IC333.16(O4)
N$383: IC60.14(D6) IC333.17(O5)
N$384: IC60.17(D7) IC333.18(O6)
N$385: IC60.18(D8) IC333.19(O7)
N$388: IC108.13(B:CLR) IC146.6(B:O)
N$389: IC137.9(B:Q)
N$392: IC107.5(A:Q)
N$394: IC108.5(A:Q)
N$395: IC108.9(B:Q)
N$396: IC137.5(A:Q)
N$397: IC146.12(D:I0) IC149.7(Y7)
N$398: IC143.5(B:I1) IC149.14(Y1)
N$399: IC143.10(C:I1) IC149.13(Y2)
N$403: IC146.1(A:I0) IC149.11(Y4)
N$405: IC146.9(C:I0) IC149.9(Y6)
N$406: IC137.13(B:CLR) IC146.11(D:O)
N$408: IC74.13(B:CLR) IC143.6(B:O)
N$409: IC107.1(A:CLR) IC143.8(C:O)
N$410: IC137.1(A:CLR) IC146.8(C:O)
N$413: IC105.2 IC139.8(C:O)
N$416: IC105.1 IC139.11(D:O)
N$418: IC105.13 IC148.3(A:O)
N$420: IC105.12 IC148.6(B:O)
N$436: IC105.10 IC148.11(D:O)
N$442: IC76.3(D1) IC199.11(O0)
N$443: IC76.4(D2) IC199.12(O1)
N$444: IC107.9(B:Q)
N$445: IC60.11(CLK)
N$449: IC75.17(D7) IC227.18(O6)
N$450: IC75.18(D8) IC227.19(O7)
N$451: IC76.7(D3) IC199.13(O2)
N$452: IC76.8(D4) IC199.15(O3)
N$453: IC76.13(D5) IC199.16(O4)
N$454: IC76.14(D6) IC199.17(O5)
N$455: IC76.17(D7) IC199.18(O6)
N$456: IC76.18(D8) IC199.19(O7)
N$457: IC77.3(D1) IC243.11(O0)
N$458: IC77.4(D2) IC243.12(O1)
N$459: IC77.7(D3) IC243.13(O2)
N$460: IC77.8(D4) IC243.15(O3)
N$461: IC77.13(D5) IC243.16(O4)
N$462: IC77.14(D6) IC243.17(O5)
N$463: IC77.17(D7) IC243.18(O6)
N$464: IC77.18(D8) IC243.19(O7)
N$465: IC78.3(D1) IC257.11(O0)
N$466: IC78.4(D2) IC257.12(O1)
N$467: IC78.7(D3) IC257.13(O2)
N$468: IC78.8(D4) IC257.15(O3)
N$469: IC78.13(D5) IC257.16(O4)
N$470: IC78.14(D6) IC257.17(O5)
N$471: IC78.17(D7) IC257.18(O6)
N$472: IC78.18(D8) IC257.19(O7)
N$473: IC79.3(D1) IC261.11(O0)
N$474: IC79.4(D2) IC261.12(O1)
N$475: IC79.7(D3) IC261.13(O2)
N$476: IC79.8(D4) IC261.15(O3)
N$477: IC79.13(D5) IC261.16(O4)
N$478: IC79.14(D6) IC261.17(O5)
N$479: IC79.17(D7) IC261.18(O6)
N$480: IC79.18(D8) IC261.19(O7)
N$495: IC75.11(CLK)
N$496: IC75.1(CLR)
N$503: IC134.18(D8) IC262.19(O7)
N$504: IC134.17(D7) IC262.18(O6)
N$505: IC134.14(D6) IC262.17(O5)
N$506: IC134.13(D5) IC262.16(O4)
N$507: IC134.8(D4) IC262.15(O3)
N$508: IC134.7(D3) IC262.13(O2)
N$509: IC134.4(D2) IC262.12(O1)
N$510: IC134.3(D1) IC262.11(O0)
N$511: IC135.3(D1) IC302.11(O0)
N$512: IC135.4(D2) IC302.12(O1)
N$513: IC135.7(D3) IC302.13(O2)
N$514: IC135.8(D4) IC302.15(O3)
N$515: IC135.13(D5) IC302.16(O4)
N$516: IC135.14(D6) IC302.17(O5)
N$517: IC135.17(D7) IC302.18(O6)
N$518: IC135.18(D8) IC302.19(O7)
N$519: IC136.3(D1) IC303.11(O0)
N$520: IC136.4(D2) IC303.12(O1)
N$521: IC136.7(D3) IC303.13(O2)
N$522: IC136.8(D4) IC303.15(O3)
N$523: IC136.13(D5) IC303.16(O4)
N$524: IC136.14(D6) IC303.17(O5)
N$525: IC136.17(D7) IC303.18(O6)
N$526: IC136.18(D8) IC303.19(O7)
N$567: IC76.1(CLR)
N$569: IC76.11(CLK)
N$577: IC77.1(CLR)
N$578: IC77.11(CLK)
N$579: IC78.1(CLR)
N$580: IC78.11(CLK)
N$581: IC79.1(CLR)
N$582: IC79.11(CLK)
N$583: IC134.1(CLR)
N$584: IC134.11(CLK)
N$585: IC135.1(CLR)
N$586: IC135.11(CLK)
N$587: IC136.1(CLR)
N$588: IC136.11(CLK)
N$609: IC3.5(Y) IC180.6(1C0)
N$610: IC2.5(Y) IC180.5(1C1)
N$611: IC9.5(Y) IC180.4(1C2)
N$685: IC143.12(D:I0) IC149.12(Y3)
N$687: IC146.4(B:I0) IC149.10(Y5)
N$690: IC74.9(B:Q)
N$693: INT_STATUS_REG.4(D2)
N$694: INT_STATUS_REG.7(D3)
N$695: INT_STATUS_REG.8(D4)
N$696: INT_STATUS_REG.13(D5)
N$697: INT_STATUS_REG.14(D6)
N$698: INT_STATUS_REG.17(D7)
N$699: INT_STATUS_REG.18(D8)
N$1067: IC115.3(B:I) IC412.3(Q1)
N$2882: IC105.7(A1) INT_CODE_REG1.7(3D)
N$28845: IC105.6(A2) INT_CODE_REG1.8(4D)
NET563434: IC120.2(A:A1) SW1.9 SW1.10 SW1.11 SW1.12 SW1.13 SW1.14 SW1.15 SW1.16
OF_IN_SRC_0: IC23.11(A)
OF_IN_SRC_1: IC23.10(B)
OF_IN_SRC_2: IC23.9(C)
PAGE_PRESENT: IC65.3(B:Y4)
PAGE_TABLE_ADDR_SOURCE: IC18.8(C:O) IC142.1(!A!/B) IC147.1(!A!/B)
PAGE_TABLE_WE: IC138.9(D:I)
PAGE_WRITEABLE: IC72.18(A:Y1)
PANEL_ADDRESS_0: IC223.2(A:A1)
PANEL_ADDRESS_1: IC223.4(A:A2)
PANEL_ADDRESS_2: IC223.6(A:A3)
PANEL_ADDRESS_3: IC223.8(A:A4)
PANEL_ADDRESS_4: IC222.2(A:A1)
PANEL_ADDRESS_5: IC222.4(A:A2)
PANEL_ADDRESS_6: IC222.6(A:A3)
PANEL_ADDRESS_7: IC222.8(A:A4)
PANEL_ADDRESS_8: IC224.2(A:A1)
PANEL_ADDRESS_9: IC224.4(A:A2)
PANEL_ADDRESS_10: IC224.6(A:A3)
PANEL_ADDRESS_11: IC224.8(A:A4)
PANEL_ADDRESS_12: IC225.2(A:A1)
PANEL_ADDRESS_13: IC225.4(A:A2)
PANEL_ADDRESS_14: IC225.6(A:A3)
PANEL_ADDRESS_15: IC225.8(A:A4)
PANEL_ADDRESS_16: IC228.2(A:A1)
PANEL_ADDRESS_17: IC228.4(A:A2)
PANEL_ADDRESS_18: IC228.6(A:A3)
PANEL_ADDRESS_19: IC228.8(A:A4)
PANEL_ADDRESS_20: IC229.2(A:A1)
PANEL_ADDRESS_21: IC229.4(A:A2)
PANEL_DATA_0: IC219.2(A:A1)
PANEL_DATA_1: IC219.4(A:A2)
PANEL_DATA_2: IC219.6(A:A3)
PANEL_DATA_3: IC219.8(A:A4)
PANEL_DATA_4: IC218.2(A:A1)
PANEL_DATA_5: IC218.4(A:A2)
PANEL_DATA_6: IC218.6(A:A3)
PANEL_DATA_7: IC218.8(A:A4)
PANEL_MEM_IO: IC27.6(A:A3) IC194.4(A:Q)
PANEL_RD: IC27.2(A:A1) IC192.4(A:Q)
PANEL_REGSEL_0: IC125.2(1A) R6.1 SW4.1
PANEL_REGSEL_1: IC125.5(2A) R7.1 SW4.2
PANEL_REGSEL_2: IC125.11(3A) R8.1 SW4.3
PANEL_REGSEL_3: IC125.14(4A) R9.1 SW4.4
PANEL_REGSEL_4: IC118.2(1A) R10.1 SW4.5
PANEL_WR: IC27.4(A:A2) IC193.4(A:Q)
PC_H_0: IC9.3(D1) IC129.3(1B)
PC_H_1: IC5.3(D1) IC129.6(2B)
PC_H_2: IC30.3(D1) IC129.10(3B)
PC_H_3: IC53.3(D1) IC129.13(4B)
PC_H_4: IC67.3(D1) IC132.3(1B)
PC_H_5: IC71.3(D1) IC132.6(2B)
PC_H_6: IC84.3(D1) IC132.10(3B)
PC_H_7: IC87.3(D1) IC132.13(4B)
PC_H_15: IC101.19(8Q)
PC_H_WRT: IC101.1(G)
PC_L_0: IC9.4(D0) IC102.2(1Q) IC131.3(1B)
PC_L_1: IC5.4(D0) IC102.5(2Q) IC131.6(2B)
PC_L_2: IC30.4(D0) IC102.6(3Q) IC131.10(3B)
PC_L_3: IC53.4(D0) IC131.13(4B)
PC_L_4: IC67.4(D0) IC128.3(1B)
PC_L_5: IC71.4(D0) IC128.6(2B)
PC_L_6: IC84.4(D0) IC128.10(3B)
PC_L_7: IC87.4(D0) IC128.13(4B)
PC_L_WRT: IC102.1(G)
PIO_0: IC254.12(Y3)
PIO_1: IC254.11(Y4)
PTB_WRT: IC66.1(G)
RD: IC155.9(D:I)
RESET: IC411.1(A:R) R24.1 SW5.13
RST: IC115.5(C:I) IC412.15(CLR) R2.1 SW5.16
RTC: IC254.13(Y2)
SET: IC411.2(A:S1) IC411.3(A:S2) R23.1 SW5.14
SF_IN_SRC_0: IC255.14(A)
SF_IN_SRC_1: IC255.2(B)
SF_XOR_OF1: IC59.6(B:O) IC61.15(D4) IC153.4(B:I0)
SHIFT_SRC_0: IC16.11(A)
SHIFT_SRC_1: IC16.10(B)
SHIFT_SRC_2: IC16.9(C)
SI_H_0: IC2.14(D5) IC31.2(1Q)
SI_H_1: IC20.14(D5) IC31.5(2Q)
SI_H_2: IC31.6(3Q) IC44.14(D5)
SI_H_3: IC31.9(4Q) IC62.14(D5)
SI_H_4: IC31.12(5Q) IC69.14(D5)
SI_H_5: IC31.15(6Q) IC82.14(D5)
SI_H_6: IC31.16(7Q) IC86.14(D5)
SI_H_7: IC31.19(8Q) IC89.14(D5)
SI_L_0: IC2.15(D4) IC106.2(1Q)
SI_L_1: IC20.15(D4) IC106.5(2Q)
SI_L_2: IC44.15(D4) IC106.6(3Q)
SI_L_3: IC62.15(D4) IC106.9(4Q)
SI_L_4: IC69.15(D4) IC106.12(5Q)
SI_L_5: IC82.15(D4) IC106.15(6Q)
SI_L_6: IC86.15(D4) IC106.16(7Q)
SI_L_7: IC89.15(D4) IC106.19(8Q)
SINGLE_STEP_CLK: IC411.4(A:Q) SW1.1
SP_H_0: IC2.3(D1) IC245.2(1Q)
SP_H_1: IC20.3(D1) IC245.5(2Q)
SP_H_2: IC44.3(D1) IC245.6(3Q)
SP_H_3: IC62.3(D1) IC245.9(4Q)
SP_H_4: IC69.3(D1) IC245.12(5Q)
SP_H_5: IC82.3(D1) IC245.15(6Q)
SP_H_6: IC86.3(D1) IC245.16(7Q)
SP_H_7: IC89.3(D1) IC245.19(8Q)
SP_L_0: IC2.4(D0) IC260.2(1Q)
SP_L_1: IC20.4(D0) IC260.5(2Q)
SP_L_2: IC44.4(D0) IC260.6(3Q)
SP_L_3: IC62.4(D0) IC260.9(4Q)
SP_L_4: IC69.4(D0) IC260.12(5Q)
SP_L_5: IC82.4(D0) IC260.15(6Q)
SP_L_6: IC86.4(D0) IC260.16(7Q)
SP_L_7: IC89.4(D0) IC260.19(8Q)
SPH_WRT: IC245.1(G)
SPL_WRT: IC260.1(G)
STOP_CLK_REQ: IC126.2(A:D) R26.1 SW5.15
STOP_CLOCK: IC126.5(A:Q) IC412.9(G1) IC412.10(G2)
TDR_H_0: IC9.12(D7) IC92.3(1C3)
TDR_H_1: IC5.12(D7) IC92.13(2C3)
TDR_H_2: IC30.12(D7) IC103.3(1C3)
TDR_H_3: IC53.12(D7) IC103.13(2C3)
TDR_H_4: IC67.12(D7) IC116.3(1C3)
TDR_H_5: IC71.12(D7) IC116.13(2C3)
TDR_H_6: IC84.12(D7) IC124.3(1C3)
TDR_H_7: IC87.12(D7) IC124.13(2C3)
TDR_H_WRT: IC158.1(G)
TDR_L_0: IC9.13(D6) IC92.4(1C2)
TDR_L_1: IC5.13(D6) IC92.12(2C2)
TDR_L_2: IC30.13(D6) IC103.4(1C2)
TDR_L_3: IC53.13(D6) IC103.12(2C2)
TDR_L_4: IC67.13(D6) IC116.4(1C2)
TDR_L_5: IC71.13(D6) IC116.12(2C2)
TDR_L_6: IC84.13(D6) IC124.4(1C2)
TDR_L_7: IC87.13(D6) IC124.12(2C2)
TDR_L_WRT: IC157.1(G)
TIMER: IC254.9(Y6)
TYP0: IC43.9(D:I) IC94.4(B:I0)
TYP1: IC45.1(A:I0) IC93.1(A:I0)
TYP_0: IC145.1(A:I0)
TYP_1: IC43.1(A:I)
U_AD0: IC32.2(Q1) IC227.10(A0)
U_AD1: IC32.5(Q2) IC227.9(A1)
U_AD2: IC32.6(Q3) IC227.8(A2)
U_AD3: IC32.9(Q4) IC227.7(A3)
U_AD4: IC32.12(Q5) IC227.6(A4)
U_AD5: IC32.15(Q6) IC227.5(A5)
U_AD6: IC32.16(Q7) IC227.4(A6)
U_AD7: IC32.19(Q8) IC227.3(A7)
U_AD8: IC33.2(Q1) IC227.25(A8)
U_AD9: IC33.5(Q2) IC227.24(A9)
U_AD10: IC33.6(Q3) IC227.21(A10)
U_AD11: IC33.9(Q4) IC227.23(A11)
U_AD12: IC33.12(Q5) IC46.5(A1) IC199.2(A12) IC227.2(A12) IC243.2(A12) IC257.2(A12) IC261.2(A12) IC262.2(A12) IC302.2(A12) IC303.2(A12) IC333.2(A12) IC335.2(A12) IC337.2(A12) IC339.2(A12)
U_AD13: IC33.15(Q6) IC46.3(A2) IC199.26(A13) IC227.26(A13) IC243.26(A13) IC257.26(A13) IC261.26(A13) IC262.26(A13) IC302.26(A13) IC303.26(A13) IC333.26(A13) IC335.26(A13) IC337.26(A13) IC339.26(A13)
U_AD16: IC333.10(A0)
U_AD17: IC333.9(A1)
U_AD18: IC333.8(A2)
U_AD19: IC333.7(A3)
U_AD20: IC333.6(A4)
U_AD21: IC333.5(A5)
U_AD22: IC333.4(A6)
U_AD23: IC333.3(A7)
U_AD24: IC333.25(A8)
U_AD25: IC333.24(A9)
U_AD26: IC333.21(A10)
U_AD27: IC333.23(A11)
U_AD32: IC199.10(A0)
U_AD33: IC199.9(A1)
U_AD34: IC199.8(A2)
U_AD35: IC199.7(A3)
U_AD36: IC199.6(A4)
U_AD37: IC199.5(A5)
U_AD38: IC199.4(A6)
U_AD39: IC199.3(A7)
U_AD40: IC199.25(A8)
U_AD41: IC199.24(A9)
U_AD42: IC199.21(A10)
U_AD43: IC199.23(A11)
U_AD48: IC243.10(A0)
U_AD49: IC243.9(A1)
U_AD50: IC243.8(A2)
U_AD51: IC243.7(A3)
U_AD52: IC243.6(A4)
U_AD53: IC243.5(A5)
U_AD54: IC243.4(A6)
U_AD55: IC243.3(A7)
U_AD56: IC243.25(A8)
U_AD57: IC243.24(A9)
U_AD58: IC243.21(A10)
U_AD59: IC243.23(A11)
U_AD64: IC257.10(A0)
U_AD65: IC257.9(A1)
U_AD66: IC257.8(A2)
U_AD67: IC257.7(A3)
U_AD68: IC257.6(A4)
U_AD69: IC257.5(A5)
U_AD70: IC257.4(A6)
U_AD71: IC257.3(A7)
U_AD72: IC257.25(A8)
U_AD73: IC257.24(A9)
U_AD74: IC257.21(A10)
U_AD75: IC257.23(A11)
U_AD80: IC261.10(A0)
U_AD81: IC261.9(A1)
U_AD82: IC261.8(A2)
U_AD83: IC261.7(A3)
U_AD84: IC261.6(A4)
U_AD85: IC261.5(A5)
U_AD86: IC261.4(A6)
U_AD87: IC261.3(A7)
U_AD88: IC261.25(A8)
U_AD89: IC261.24(A9)
U_AD90: IC261.21(A10)
U_AD91: IC261.23(A11)
U_AD96: IC262.10(A0)
U_AD97: IC262.9(A1)
U_AD98: IC262.8(A2)
U_AD99: IC262.7(A3)
U_AD100: IC262.6(A4)
U_AD101: IC262.5(A5)
U_AD102: IC262.4(A6)
U_AD103: IC262.3(A7)
U_AD104: IC262.25(A8)
U_AD105: IC262.24(A9)
U_AD106: IC262.21(A10)
U_AD107: IC262.23(A11)
U_AD112: IC302.10(A0)
U_AD113: IC302.9(A1)
U_AD114: IC302.8(A2)
U_AD115: IC302.7(A3)
U_AD116: IC302.6(A4)
U_AD117: IC302.5(A5)
U_AD118: IC302.4(A6)
U_AD119: IC302.3(A7)
U_AD120: IC302.25(A8)
U_AD121: IC302.24(A9)
U_AD122: IC302.21(A10)
U_AD123: IC302.23(A11)
U_AD128: IC303.10(A0)
U_AD129: IC303.9(A1)
U_AD130: IC303.8(A2)
U_AD131: IC303.7(A3)
U_AD132: IC303.6(A4)
U_AD133: IC303.5(A5)
U_AD134: IC303.4(A6)
U_AD135: IC303.3(A7)
U_AD136: IC303.25(A8)
U_AD137: IC303.24(A9)
U_AD138: IC303.21(A10)
U_AD139: IC303.23(A11)
U_AD224: IC335.10(A0)
U_AD225: IC335.9(A1)
U_AD226: IC335.8(A2)
U_AD227: IC335.7(A3)
U_AD228: IC335.6(A4)
U_AD229: IC335.5(A5)
U_AD230: IC335.4(A6)
U_AD231: IC335.3(A7)
U_AD232: IC335.25(A8)
U_AD233: IC335.24(A9)
U_AD234: IC335.21(A10)
U_AD235: IC335.23(A11)
U_AD240: IC337.10(A0)
U_AD241: IC337.9(A1)
U_AD242: IC337.8(A2)
U_AD243: IC337.7(A3)
U_AD244: IC337.6(A4)
U_AD245: IC337.5(A5)
U_AD246: IC337.4(A6)
U_AD247: IC337.3(A7)
U_AD248: IC337.25(A8)
U_AD249: IC337.24(A9)
U_AD250: IC337.21(A10)
U_AD251: IC337.23(A11)
U_AD256: IC339.10(A0)
U_AD257: IC339.9(A1)
U_AD258: IC339.8(A2)
U_AD259: IC339.7(A3)
U_AD260: IC339.6(A4)
U_AD261: IC339.5(A5)
U_AD262: IC339.4(A6)
U_AD263: IC339.3(A7)
U_AD264: IC339.25(A8)
U_AD265: IC339.24(A9)
U_AD266: IC339.21(A10)
U_AD267: IC339.23(A11)
U_ADDER_0: IC34.6(1C0) IC50.4(S1)
U_ADDER_1: IC34.10(2C0) IC50.1(S2)
U_ADDER_2: IC35.6(1C0) IC50.13(S3)
U_ADDER_3: IC35.10(2C0) IC50.10(S4)
U_ADDER_4: IC36.6(1C0) IC51.4(S1)
U_ADDER_5: IC36.10(2C0) IC51.1(S2)
U_ADDER_6: IC37.6(1C0) IC51.13(S3)
U_ADDER_7: IC37.10(2C0) IC51.10(S4)
U_ADDER_8: IC38.6(1C0) IC52.4(S1)
U_ADDER_9: IC38.10(2C0) IC52.1(S2)
U_ADDER_10: IC40.6(1C0) IC52.13(S3)
U_ADDER_11: IC40.10(2C0) IC52.10(S4)
U_ADDER_12: IC46.4(S1) IC73.6(1C0)
U_ADDER_13: IC46.1(S2) IC73.10(2C0)
U_CF: IC15.6(2B) IC16.3(D1) IC47.4(1C2) IC231.5(Q2) IC270.6(1C0)
U_CF_IN_SRC_0: IC270.14(A)
U_CF_IN_SRC_1: IC270.2(B)
U_ESC_0: IC231.12(Q5) IC256.2(1A)
U_ESC_1: IC231.15(Q6) IC256.5(2A)
U_ESC_SRC: IC256.1(!A!/B)
U_FETCH_0: IC34.4(1C2)
U_FETCH_1: IC34.12(2C2)
U_FETCH_2: IC35.4(1C2)
U_FETCH_3: IC35.12(2C2)
U_FETCH_4: IC36.4(1C2)
U_FETCH_5: IC36.12(2C2)
U_FETCH_6: IC37.4(1C2)
U_FETCH_7: IC37.12(2C2)
U_FETCH_8: IC38.4(1C2)
U_FETCH_9: IC38.12(2C2)
U_FETCH_10: IC40.4(1C2)
U_FETCH_11: IC40.12(2C2)
U_FETCH_12: IC73.4(1C2)